# Altium project AMC_FMC_Carrier.PrjPcb (part 5 of 9)

## Sheet FPGA_SUP.SchDoc
size A2; DocumentNumber: 16; SheetNumber: 16; SheetTotal: 30
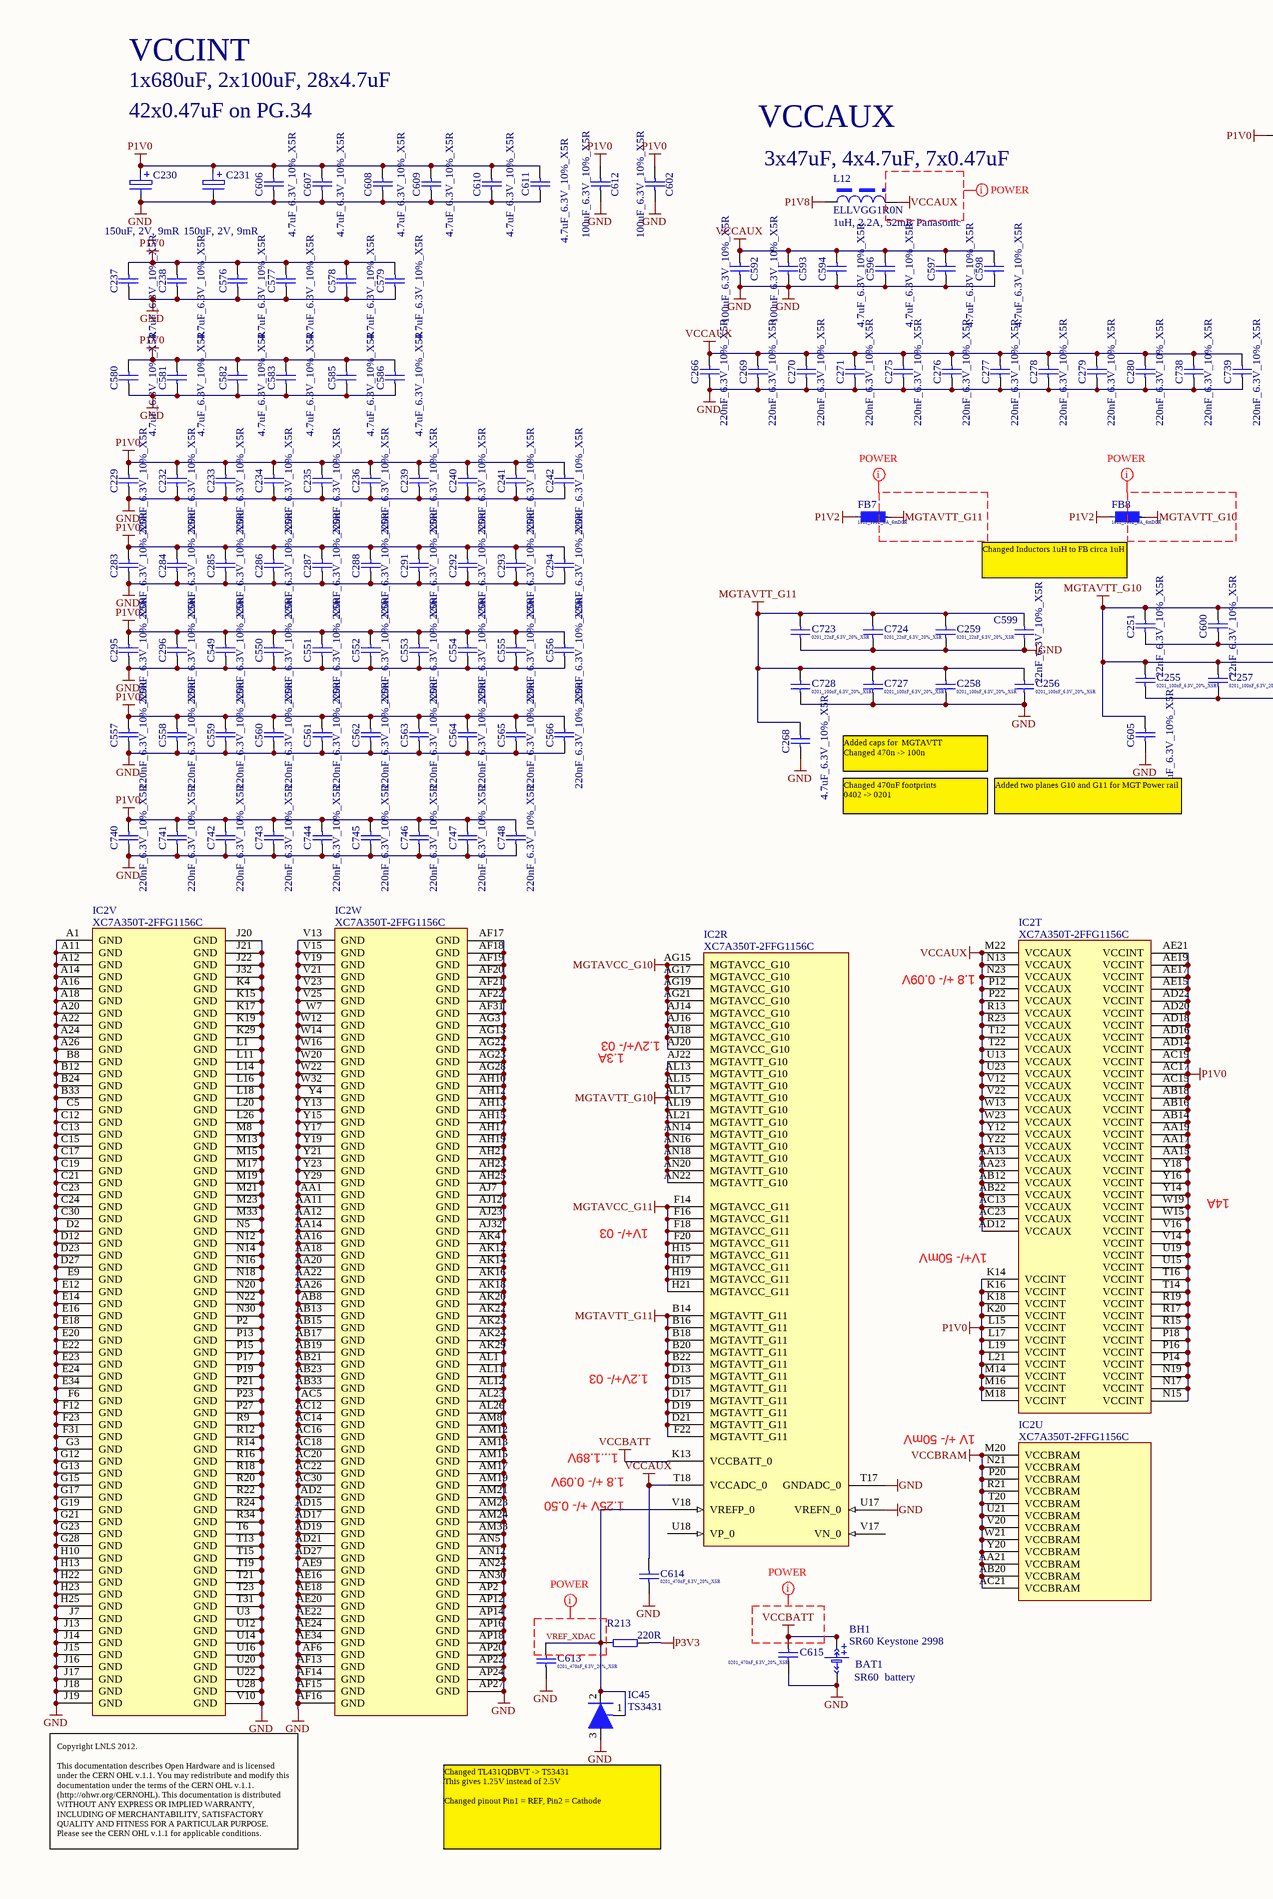
[diagram p9: FPGA_SUP.SchDoc, left]
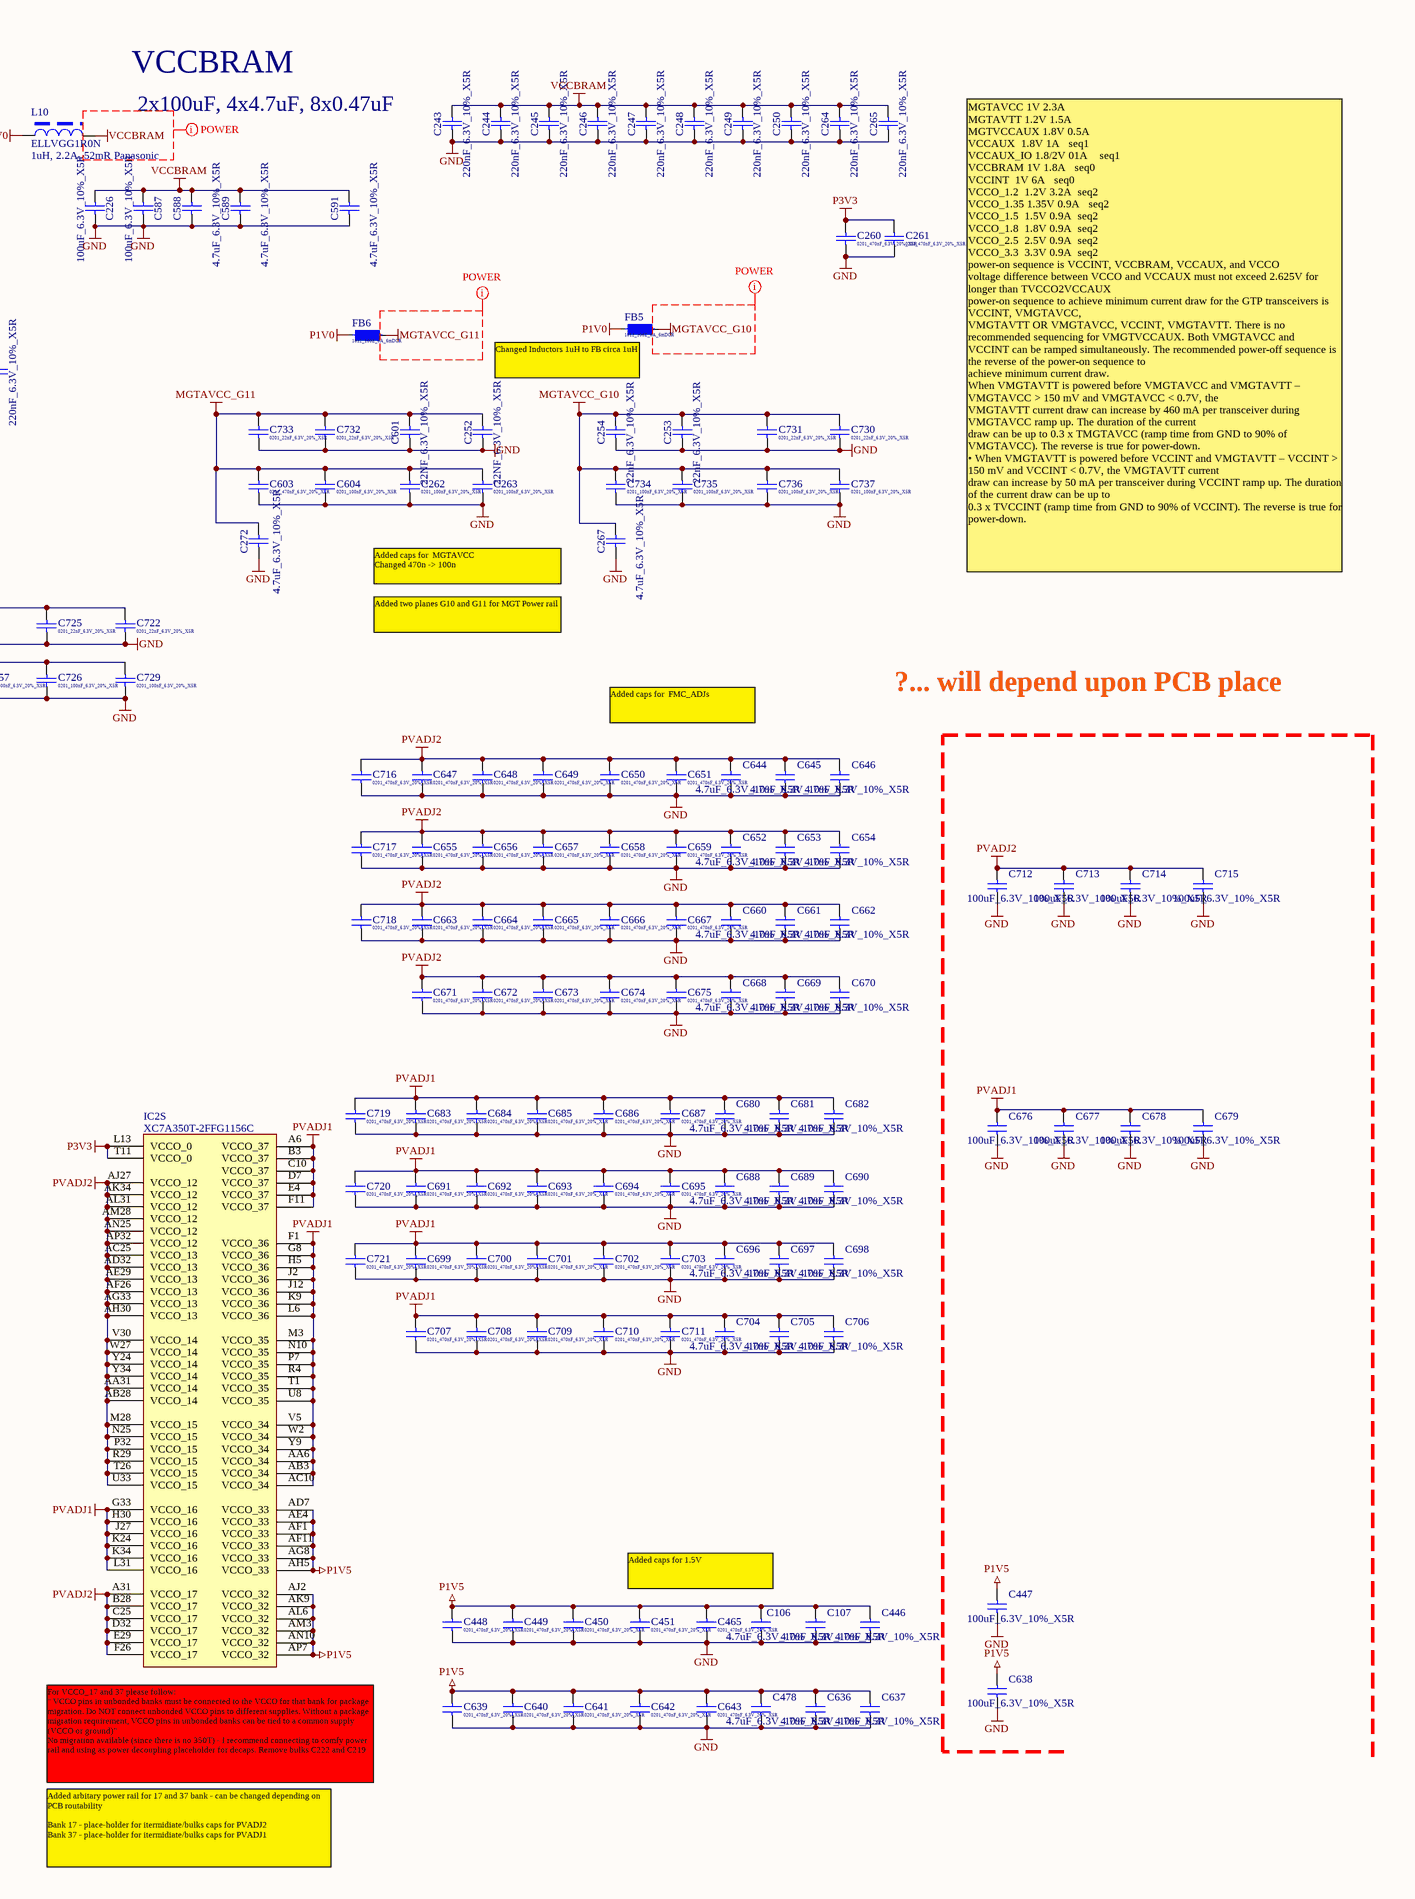
[diagram p10: FPGA_SUP.SchDoc, right]

### Parts
BAT1  SR60  battery  [SR60]
BH1  SR60 Keystone 2998  [keystone_2998]
C106  4.7uF_6.3V_10%_X5R  [CAPC1608X87N]
C107  4.7uF_6.3V_10%_X5R  [CAPC1608X87N]
C226  100uF_6.3V_10%_X5R  [CAPC3225X270N]
C229  220nF_6.3V_10%_X5R  [CAPC0603X33N]
C230  value 150uF, 2V, 9mR  [2917_POLY]  (hidden comment: ECASD40D157M009K00)
C231  value 150uF, 2V, 9mR  [2917_POLY]  (hidden comment: ECASD40D157M009K00)
C232  220nF_6.3V_10%_X5R  [CAPC0603X33N]
C233  220nF_6.3V_10%_X5R  [CAPC0603X33N]
C234  220nF_6.3V_10%_X5R  [CAPC0603X33N]
C235  220nF_6.3V_10%_X5R  [CAPC0603X33N]
C236  220nF_6.3V_10%_X5R  [CAPC0603X33N]
C237  4.7uF_6.3V_10%_X5R  [CAPC1608X87N]
C238  4.7uF_6.3V_10%_X5R  [CAPC1608X87N]
C239  220nF_6.3V_10%_X5R  [CAPC0603X33N]
C240  220nF_6.3V_10%_X5R  [CAPC0603X33N]
C241  220nF_6.3V_10%_X5R  [CAPC0603X33N]
C242  220nF_6.3V_10%_X5R  [CAPC0603X33N]
C243  220nF_6.3V_10%_X5R  [CAPC0603X33N]
C244  220nF_6.3V_10%_X5R  [CAPC0603X33N]
C245  220nF_6.3V_10%_X5R  [CAPC0603X33N]
C246  220nF_6.3V_10%_X5R  [CAPC0603X33N]
C247  220nF_6.3V_10%_X5R  [CAPC0603X33N]
C248  220nF_6.3V_10%_X5R  [CAPC0603X33N]
C249  220nF_6.3V_10%_X5R  [CAPC0603X33N]
C250  220nF_6.3V_10%_X5R  [CAPC0603X33N]
C251  22nF_6.3V_10%_X5R  [CAPC0603X33N]
C252  22NF_6.3V_10%_X5R  [CAPC0603X33N]
C253  22nF_6.3V_10%_X5R  [CAPC0603X33N]
C254  22nF_6.3V_10%_X5R  [CAPC0603X33N]
C255  0201_100nF_6.3V_20%_X5R  [CAPC0603X33N]
C256  0201_100nF_6.3V_20%_X5R  [CAPC0603X33N]
C257  0201_100nF_6.3V_20%_X5R  [CAPC0603X33N]
C258  0201_100nF_6.3V_20%_X5R  [CAPC0603X33N]
C259  0201_22nF_6.3V_20%_X5R  [CAPC0603X33N]
C260  0201_470nF_6.3V_20%_X5R  [CAPC0603X33N]
C261  0201_470nF_6.3V_20%_X5R  [CAPC0603X33N]
C262  0201_100nF_6.3V_20%_X5R  [CAPC0603X33N]
C263  0201_100nF_6.3V_20%_X5R  [CAPC0603X33N]
C264  220nF_6.3V_10%_X5R  [CAPC0603X33N]
C265  220nF_6.3V_10%_X5R  [CAPC0603X33N]
C266  220nF_6.3V_10%_X5R  [CAPC0603X33N]
C267  4.7uF_6.3V_10%_X5R  [CAPC1608X87N]
C268  4.7uF_6.3V_10%_X5R  [CAPC1608X87N]
C269  220nF_6.3V_10%_X5R  [CAPC0603X33N]
C270  220nF_6.3V_10%_X5R  [CAPC0603X33N]
C271  220nF_6.3V_10%_X5R  [CAPC0603X33N]
C272  4.7uF_6.3V_10%_X5R  [CAPC1608X87N]
C275  220nF_6.3V_10%_X5R  [CAPC0603X33N]
C276  220nF_6.3V_10%_X5R  [CAPC0603X33N]
C277  220nF_6.3V_10%_X5R  [CAPC0603X33N]
C278  220nF_6.3V_10%_X5R  [CAPC0603X33N]
C279  220nF_6.3V_10%_X5R  [CAPC0603X33N]
C280  220nF_6.3V_10%_X5R  [CAPC0603X33N]
C283  220nF_6.3V_10%_X5R  [CAPC0603X33N]
C284  220nF_6.3V_10%_X5R  [CAPC0603X33N]
C285  220nF_6.3V_10%_X5R  [CAPC0603X33N]
C286  220nF_6.3V_10%_X5R  [CAPC0603X33N]
C287  220nF_6.3V_10%_X5R  [CAPC0603X33N]
C288  220nF_6.3V_10%_X5R  [CAPC0603X33N]
C291  220nF_6.3V_10%_X5R  [CAPC0603X33N]
C292  220nF_6.3V_10%_X5R  [CAPC0603X33N]
C293  220nF_6.3V_10%_X5R  [CAPC0603X33N]
C294  220nF_6.3V_10%_X5R  [CAPC0603X33N]
C295  220nF_6.3V_10%_X5R  [CAPC0603X33N]
C296  220nF_6.3V_10%_X5R  [CAPC0603X33N]
C446  4.7uF_6.3V_10%_X5R  [CAPC1608X87N]
C447  100uF_6.3V_10%_X5R  [CAPC3225X270N]
C448  0201_470nF_6.3V_20%_X5R  [CAPC0603X33N]
C449  0201_470nF_6.3V_20%_X5R  [CAPC0603X33N]
C450  0201_470nF_6.3V_20%_X5R  [CAPC0603X33N]
C451  0201_470nF_6.3V_20%_X5R  [CAPC0603X33N]
C465  0201_470nF_6.3V_20%_X5R  [CAPC0603X33N]
C478  4.7uF_6.3V_10%_X5R  [CAPC1608X87N]
C549  220nF_6.3V_10%_X5R  [CAPC0603X33N]
C550  220nF_6.3V_10%_X5R  [CAPC0603X33N]
C551  220nF_6.3V_10%_X5R  [CAPC0603X33N]
C552  220nF_6.3V_10%_X5R  [CAPC0603X33N]
C553  220nF_6.3V_10%_X5R  [CAPC0603X33N]
C554  220nF_6.3V_10%_X5R  [CAPC0603X33N]
C555  220nF_6.3V_10%_X5R  [CAPC0603X33N]
C556  220nF_6.3V_10%_X5R  [CAPC0603X33N]
C557  220nF_6.3V_10%_X5R  [CAPC0603X33N]
C558  220nF_6.3V_10%_X5R  [CAPC0603X33N]
C559  220nF_6.3V_10%_X5R  [CAPC0603X33N]
C560  220nF_6.3V_10%_X5R  [CAPC0603X33N]
C561  220nF_6.3V_10%_X5R  [CAPC0603X33N]
C562  220nF_6.3V_10%_X5R  [CAPC0603X33N]
C563  220nF_6.3V_10%_X5R  [CAPC0603X33N]
C564  220nF_6.3V_10%_X5R  [CAPC0603X33N]
C565  220nF_6.3V_10%_X5R  [CAPC0603X33N]
C566  220nF_6.3V_10%_X5R  [CAPC0603X33N]
C576  4.7uF_6.3V_10%_X5R  [CAPC1608X87N]
C577  4.7uF_6.3V_10%_X5R  [CAPC1608X87N]
C578  4.7uF_6.3V_10%_X5R  [CAPC1608X87N]
C579  4.7uF_6.3V_10%_X5R  [CAPC1608X87N]
C580  4.7uF_6.3V_10%_X5R  [CAPC1608X87N]
C581  4.7uF_6.3V_10%_X5R  [CAPC1608X87N]
C582  4.7uF_6.3V_10%_X5R  [CAPC1608X87N]
C583  4.7uF_6.3V_10%_X5R  [CAPC1608X87N]
C585  4.7uF_6.3V_10%_X5R  [CAPC1608X87N]
C586  4.7uF_6.3V_10%_X5R  [CAPC1608X87N]
C587  100uF_6.3V_10%_X5R  [CAPC3225X270N]
C588  4.7uF_6.3V_10%_X5R  [CAPC1608X87N]
C589  4.7uF_6.3V_10%_X5R  [CAPC1608X87N]
C591  4.7uF_6.3V_10%_X5R  [CAPC1608X87N]
C592  100uF_6.3V_10%_X5R  [CAPC3225X270N]
C593  100uF_6.3V_10%_X5R  [CAPC3225X270N]
C594  4.7uF_6.3V_10%_X5R  [CAPC1608X87N]
C596  4.7uF_6.3V_10%_X5R  [CAPC1608X87N]
C597  4.7uF_6.3V_10%_X5R  [CAPC1608X87N]
C598  4.7uF_6.3V_10%_X5R  [CAPC1608X87N]
C599  22nF_6.3V_10%_X5R  [CAPC0603X33N]
C600  22nF_6.3V_10%_X5R  [CAPC0603X33N]
C601  22NF_6.3V_10%_X5R  [CAPC0603X33N]
C602  100uF_6.3V_10%_X5R  [CAPC3225X270N]
C603  0201_470nF_6.3V_20%_X5R  [CAPC0603X33N]
C604  0201_100nF_6.3V_20%_X5R  [CAPC0603X33N]
C605  4.7uF_6.3V_10%_X5R  [CAPC1608X87N]
C606  4.7uF_6.3V_10%_X5R  [CAPC1608X87N]
C607  4.7uF_6.3V_10%_X5R  [CAPC1608X87N]
C608  4.7uF_6.3V_10%_X5R  [CAPC1608X87N]
C609  4.7uF_6.3V_10%_X5R  [CAPC1608X87N]
C610  4.7uF_6.3V_10%_X5R  [CAPC1608X87N]
C611  4.7uF_6.3V_10%_X5R  [CAPC1608X87N]
C612  100uF_6.3V_10%_X5R  [CAPC3225X270N]
C613  0201_470nF_6.3V_20%_X5R  [CAPC0603X33N]
C614  0201_470nF_6.3V_20%_X5R  [CAPC0603X33N]
C615  0201_470nF_6.3V_20%_X5R  [CAPC0603X33N]
C636  4.7uF_6.3V_10%_X5R  [CAPC1608X87N]
C637  4.7uF_6.3V_10%_X5R  [CAPC1608X87N]
C638  100uF_6.3V_10%_X5R  [CAPC3225X270N]
C639  0201_470nF_6.3V_20%_X5R  [CAPC0603X33N]
C640  0201_470nF_6.3V_20%_X5R  [CAPC0603X33N]
C641  0201_470nF_6.3V_20%_X5R  [CAPC0603X33N]
C642  0201_470nF_6.3V_20%_X5R  [CAPC0603X33N]
C643  0201_470nF_6.3V_20%_X5R  [CAPC0603X33N]
C644  4.7uF_6.3V_10%_X5R  [CAPC1608X87N]
C645  4.7uF_6.3V_10%_X5R  [CAPC1608X87N]
C646  4.7uF_6.3V_10%_X5R  [CAPC1608X87N]
C647  0201_470nF_6.3V_20%_X5R  [CAPC0603X33N]
C648  0201_470nF_6.3V_20%_X5R  [CAPC0603X33N]
C649  0201_470nF_6.3V_20%_X5R  [CAPC0603X33N]
C650  0201_470nF_6.3V_20%_X5R  [CAPC0603X33N]
C651  0201_470nF_6.3V_20%_X5R  [CAPC0603X33N]
C652  4.7uF_6.3V_10%_X5R  [CAPC1608X87N]
C653  4.7uF_6.3V_10%_X5R  [CAPC1608X87N]
C654  4.7uF_6.3V_10%_X5R  [CAPC1608X87N]
C655  0201_470nF_6.3V_20%_X5R  [CAPC0603X33N]
C656  0201_470nF_6.3V_20%_X5R  [CAPC0603X33N]
C657  0201_470nF_6.3V_20%_X5R  [CAPC0603X33N]
C658  0201_470nF_6.3V_20%_X5R  [CAPC0603X33N]
C659  0201_470nF_6.3V_20%_X5R  [CAPC0603X33N]
C660  4.7uF_6.3V_10%_X5R  [CAPC1608X87N]
C661  4.7uF_6.3V_10%_X5R  [CAPC1608X87N]
C662  4.7uF_6.3V_10%_X5R  [CAPC1608X87N]
C663  0201_470nF_6.3V_20%_X5R  [CAPC0603X33N]
C664  0201_470nF_6.3V_20%_X5R  [CAPC0603X33N]
C665  0201_470nF_6.3V_20%_X5R  [CAPC0603X33N]
C666  0201_470nF_6.3V_20%_X5R  [CAPC0603X33N]
C667  0201_470nF_6.3V_20%_X5R  [CAPC0603X33N]
C668  4.7uF_6.3V_10%_X5R  [CAPC1608X87N]
C669  4.7uF_6.3V_10%_X5R  [CAPC1608X87N]
C670  4.7uF_6.3V_10%_X5R  [CAPC1608X87N]
C671  0201_470nF_6.3V_20%_X5R  [CAPC0603X33N]
C672  0201_470nF_6.3V_20%_X5R  [CAPC0603X33N]
C673  0201_470nF_6.3V_20%_X5R  [CAPC0603X33N]
C674  0201_470nF_6.3V_20%_X5R  [CAPC0603X33N]
C675  0201_470nF_6.3V_20%_X5R  [CAPC0603X33N]
C676  100uF_6.3V_10%_X5R  [CAPC3225X270N]
C677  100uF_6.3V_10%_X5R  [CAPC3225X270N]
C678  100uF_6.3V_10%_X5R  [CAPC3225X270N]
C679  100uF_6.3V_10%_X5R  [CAPC3225X270N]
C680  4.7uF_6.3V_10%_X5R  [CAPC1608X87N]
C681  4.7uF_6.3V_10%_X5R  [CAPC1608X87N]
C682  4.7uF_6.3V_10%_X5R  [CAPC1608X87N]
C683  0201_470nF_6.3V_20%_X5R  [CAPC0603X33N]
C684  0201_470nF_6.3V_20%_X5R  [CAPC0603X33N]
C685  0201_470nF_6.3V_20%_X5R  [CAPC0603X33N]
C686  0201_470nF_6.3V_20%_X5R  [CAPC0603X33N]
C687  0201_470nF_6.3V_20%_X5R  [CAPC0603X33N]
C688  4.7uF_6.3V_10%_X5R  [CAPC1608X87N]
C689  4.7uF_6.3V_10%_X5R  [CAPC1608X87N]
C690  4.7uF_6.3V_10%_X5R  [CAPC1608X87N]
C691  0201_470nF_6.3V_20%_X5R  [CAPC0603X33N]
C692  0201_470nF_6.3V_20%_X5R  [CAPC0603X33N]
C693  0201_470nF_6.3V_20%_X5R  [CAPC0603X33N]
C694  0201_470nF_6.3V_20%_X5R  [CAPC0603X33N]
C695  0201_470nF_6.3V_20%_X5R  [CAPC0603X33N]
C696  4.7uF_6.3V_10%_X5R  [CAPC1608X87N]
C697  4.7uF_6.3V_10%_X5R  [CAPC1608X87N]
C698  4.7uF_6.3V_10%_X5R  [CAPC1608X87N]
C699  0201_470nF_6.3V_20%_X5R  [CAPC0603X33N]
C700  0201_470nF_6.3V_20%_X5R  [CAPC0603X33N]
C701  0201_470nF_6.3V_20%_X5R  [CAPC0603X33N]
C702  0201_470nF_6.3V_20%_X5R  [CAPC0603X33N]
C703  0201_470nF_6.3V_20%_X5R  [CAPC0603X33N]
C704  4.7uF_6.3V_10%_X5R  [CAPC1608X87N]
C705  4.7uF_6.3V_10%_X5R  [CAPC1608X87N]
C706  4.7uF_6.3V_10%_X5R  [CAPC1608X87N]
C707  0201_470nF_6.3V_20%_X5R  [CAPC0603X33N]
C708  0201_470nF_6.3V_20%_X5R  [CAPC0603X33N]
C709  0201_470nF_6.3V_20%_X5R  [CAPC0603X33N]
C710  0201_470nF_6.3V_20%_X5R  [CAPC0603X33N]
C711  0201_470nF_6.3V_20%_X5R  [CAPC0603X33N]
C712  100uF_6.3V_10%_X5R  [CAPC3225X270N]
C713  100uF_6.3V_10%_X5R  [CAPC3225X270N]
C714  100uF_6.3V_10%_X5R  [CAPC3225X270N]
C715  100uF_6.3V_10%_X5R  [CAPC3225X270N]
C716  0201_470nF_6.3V_20%_X5R  [CAPC0603X33N]
C717  0201_470nF_6.3V_20%_X5R  [CAPC0603X33N]
C718  0201_470nF_6.3V_20%_X5R  [CAPC0603X33N]
C719  0201_470nF_6.3V_20%_X5R  [CAPC0603X33N]
C720  0201_470nF_6.3V_20%_X5R  [CAPC0603X33N]
C721  0201_470nF_6.3V_20%_X5R  [CAPC0603X33N]
C722  0201_22nF_6.3V_20%_X5R  [CAPC0603X33N]
C723  0201_22nF_6.3V_20%_X5R  [CAPC0603X33N]
C724  0201_22nF_6.3V_20%_X5R  [CAPC0603X33N]
C725  0201_22nF_6.3V_20%_X5R  [CAPC0603X33N]
C726  0201_100nF_6.3V_20%_X5R  [CAPC0603X33N]
C727  0201_100nF_6.3V_20%_X5R  [CAPC0603X33N]
C728  0201_100nF_6.3V_20%_X5R  [CAPC0603X33N]
C729  0201_100nF_6.3V_20%_X5R  [CAPC0603X33N]
C730  0201_22nF_6.3V_20%_X5R  [CAPC0603X33N]
C731  0201_22nF_6.3V_20%_X5R  [CAPC0603X33N]
C732  0201_22nF_6.3V_20%_X5R  [CAPC0603X33N]
C733  0201_22nF_6.3V_20%_X5R  [CAPC0603X33N]
C734  0201_100nF_6.3V_20%_X5R  [CAPC0603X33N]
C735  0201_100nF_6.3V_20%_X5R  [CAPC0603X33N]
C736  0201_100nF_6.3V_20%_X5R  [CAPC0603X33N]
C737  0201_100nF_6.3V_20%_X5R  [CAPC0603X33N]
C738  220nF_6.3V_10%_X5R  [CAPC0603X33N]
C739  220nF_6.3V_10%_X5R  [CAPC0603X33N]
C740  220nF_6.3V_10%_X5R  [CAPC0603X33N]
C741  220nF_6.3V_10%_X5R  [CAPC0603X33N]
C742  220nF_6.3V_10%_X5R  [CAPC0603X33N]
C743  220nF_6.3V_10%_X5R  [CAPC0603X33N]
C744  220nF_6.3V_10%_X5R  [CAPC0603X33N]
C745  220nF_6.3V_10%_X5R  [CAPC0603X33N]
C746  220nF_6.3V_10%_X5R  [CAPC0603X33N]
C747  220nF_6.3V_10%_X5R  [CAPC0603X33N]
C748  220nF_6.3V_10%_X5R  [CAPC0603X33N]
FB5  1812_100Z_8A_6mDCR  [INDC4532X340N]
FB6  1812_100Z_8A_6mDCR  [INDC4532X340N]
FB7  1812_100Z_8A_6mDCR  [INDC4532X340N]
FB8  1812_100Z_8A_6mDCR  [INDC4532X340N]
IC2  XC7A350T-2FFG1156C  [BGA1156C100P34X34_3500X3500X335]  (parts R,S,T,U,V,W of 23)
IC45  TS3431  [SOT-23]
L10  ELLVGG1R0N  [L_ELLVGG2R2N]
L12  ELLVGG1R0N  [L_ELLVGG2R2N]
R213  220R  [0402R]

### Nets
GND: BH1.neg(+) C106.1 C107.1 C226.2 C229.1 C230.2 C231.2 C232.1 C233.1 C234.1 C235.1 C236.1 C237.1 C238.1 C239.1 C240.1 C241.1 C242.1 C243.1 C244.1 C245.1 C246.1 C247.1 C248.1 C249.1 C250.1 C251.1 C252.1 C253.1 C254.1 C255.1 C256.1 C257.1 C258.1 C259.1 C260.1 C261.1 C262.1 C263.1 C264.1 C265.1 C266.1 C267.1 C268.1 C269.1 C270.1 C271.1 C272.1 C275.1 C276.1 C277.1 C278.1 C279.1 C280.1 C283.1 C284.1 C285.1 C286.1 C287.1 C288.1 C291.1 C292.1 C293.1 C294.1 C295.1 C296.1 C446.1 C447.2 C448.1 C449.1 C450.1 C451.1 C465.1 C478.1 C549.1 C550.1 C551.1 C552.1 C553.1 C554.1 C555.1 C556.1 C557.1 C558.1 C559.1 C560.1 C561.1 C562.1 C563.1 C564.1 C565.1 C566.1 C576.1 C577.1 C578.1 C579.1 C580.1 C581.1 C582.1 C583.1 C585.1 C586.1 C587.2 C588.1 C589.1 C591.1 C592.2 C593.2 C594.1 C596.1 C597.1 C598.1 C599.1 C600.1 C601.1 C602.2 C603.1 C604.1 C605.1 C606.1 C607.1 C608.1 C609.1 C610.1 C611.1 C612.2 C613.1 C614.1 C615.1 C636.1 C637.1 C638.2 C639.1 C640.1 C641.1 C642.1 C643.1 C644.1 C645.1 C646.1 C647.1 C648.1 C649.1 C650.1 C651.1 C652.1 C653.1 C654.1 C655.1 C656.1 C657.1 C658.1 C659.1 C660.1 C661.1 C662.1 C663.1 C664.1 C665.1 C666.1 C667.1 C668.1 C669.1 C670.1 C671.1 C672.1 C673.1 C674.1 C675.1 C676.2 C677.2 C678.2 C679.2 C680.1 C681.1 C682.1 C683.1 C684.1 C685.1 C686.1 C687.1 C688.1 C689.1 C690.1 C691.1 C692.1 C693.1 C694.1 C695.1 C696.1 C697.1 C698.1 C699.1 C700.1 C701.1 C702.1 C703.1 C704.1 C705.1 C706.1 C707.1 C708.1 C709.1 C710.1 C711.1 C712.2 C713.2 C714.2 C715.2 C716.1 C717.1 C718.1 C719.1 C720.1 C721.1 C722.1 C723.1 C724.1 C725.1 C726.1 C727.1 C728.1 C729.1 C730.1 C731.1 C732.1 C733.1 C734.1 C735.1 C736.1 C737.1 C738.1 C739.1 C740.1 C741.1 C742.1 C743.1 C744.1 C745.1 C746.1 C747.1 C748.1 IC2.A1(GND) IC2.A11(GND) IC2.A12(GND) IC2.A14(GND) IC2.A16(GND) IC2.A18(GND) IC2.A20(GND) IC2.A22(GND) IC2.A24(GND) IC2.A26(GND) IC2.AA1(GND) IC2.AA11(GND) IC2.AA12(GND) IC2.AA14(GND) IC2.AA16(GND) IC2.AA18(GND) IC2.AA20(GND) IC2.AA22(GND) IC2.AA26(GND) IC2.AB8(GND) IC2.AB13(GND) IC2.AB15(GND) IC2.AB17(GND) IC2.AB19(GND) IC2.AB21(GND) IC2.AB23(GND) IC2.AB33(GND) IC2.AC5(GND) IC2.AC12(GND) IC2.AC14(GND) IC2.AC16(GND) IC2.AC18(GND) IC2.AC20(GND) IC2.AC22(GND) IC2.AC30(GND) IC2.AD2(GND) IC2.AD15(GND) IC2.AD17(GND) IC2.AD19(GND) IC2.AD21(GND) IC2.AD27(GND) IC2.AE9(GND) IC2.AE16(GND) IC2.AE18(GND) IC2.AE20(GND) IC2.AE22(GND) IC2.AE24(GND) IC2.AE34(GND) IC2.AF6(GND) IC2.AF13(GND) IC2.AF14(GND) IC2.AF15(GND) IC2.AF16(GND) IC2.AF17(GND) IC2.AF18(GND) IC2.AF19(GND) IC2.AF20(GND) IC2.AF21(GND) IC2.AF22(GND) IC2.AF31(GND) IC2.AG3(GND) IC2.AG13(GND) IC2.AG22(GND) IC2.AG23(GND) IC2.AG28(GND) IC2.AH10(GND) IC2.AH12(GND) IC2.AH13(GND) IC2.AH15(GND) IC2.AH17(GND) IC2.AH19(GND) IC2.AH21(GND) IC2.AH23(GND) IC2.AH25(GND) IC2.AJ7(GND) IC2.AJ12(GND) IC2.AJ23(GND) IC2.AJ32(GND) IC2.AK4(GND) IC2.AK12(GND) IC2.AK14(GND) IC2.AK16(GND) IC2.AK18(GND) IC2.AK20(GND) IC2.AK22(GND) IC2.AK23(GND) IC2.AK24(GND) IC2.AK29(GND) IC2.AL1(GND) IC2.AL11(GND) IC2.AL12(GND) IC2.AL23(GND) IC2.AL26(GND) IC2.AM8(GND) IC2.AM12(GND) IC2.AM13(GND) IC2.AM15(GND) IC2.AM17(GND) IC2.AM19(GND) IC2.AM21(GND) IC2.AM23(GND) IC2.AM24(GND) IC2.AM33(GND) IC2.AN5(GND) IC2.AN12(GND) IC2.AN24(GND) IC2.AN30(GND) IC2.AP2(GND) IC2.AP12(GND) IC2.AP14(GND) IC2.AP16(GND) IC2.AP18(GND) IC2.AP20(GND) IC2.AP22(GND) IC2.AP24(GND) IC2.AP27(GND) IC2.B8(GND) IC2.B12(GND) IC2.B24(GND) IC2.B33(GND) IC2.C5(GND) IC2.C12(GND) IC2.C13(GND) IC2.C15(GND) IC2.C17(GND) IC2.C19(GND) IC2.C21(GND) IC2.C23(GND) IC2.C24(GND) IC2.C30(GND) IC2.D2(GND) IC2.D12(GND) IC2.D23(GND) IC2.D27(GND) IC2.E9(GND) IC2.E12(GND) IC2.E14(GND) IC2.E16(GND) IC2.E18(GND) IC2.E20(GND) IC2.E22(GND) IC2.E23(GND) IC2.E24(GND) IC2.E34(GND) IC2.F6(GND) IC2.F12(GND) IC2.F23(GND) IC2.F31(GND) IC2.G3(GND) IC2.G12(GND) IC2.G13(GND) IC2.G15(GND) IC2.G17(GND) IC2.G19(GND) IC2.G21(GND) IC2.G23(GND) IC2.G28(GND) IC2.H10(GND) IC2.H13(GND) IC2.H22(GND) IC2.H23(GND) IC2.H25(GND) IC2.J7(GND) IC2.J13(GND) IC2.J14(GND) IC2.J15(GND) IC2.J16(GND) IC2.J17(GND) IC2.J18(GND) IC2.J19(GND) IC2.J20(GND) IC2.J21(GND) IC2.J22(GND) IC2.J32(GND) IC2.K4(GND) IC2.K15(GND) IC2.K17(GND) IC2.K19(GND) IC2.K29(GND) IC2.L1(GND) IC2.L11(GND) IC2.L14(GND) IC2.L16(GND) IC2.L18(GND) IC2.L20(GND) IC2.L26(GND) IC2.M8(GND) IC2.M13(GND) IC2.M15(GND) IC2.M17(GND) IC2.M19(GND) IC2.M21(GND) IC2.M23(GND) IC2.M33(GND) IC2.N5(GND) IC2.N12(GND) IC2.N14(GND) IC2.N16(GND) IC2.N18(GND) IC2.N20(GND) IC2.N22(GND) IC2.N30(GND) IC2.P2(GND) IC2.P13(GND) IC2.P15(GND) IC2.P17(GND) IC2.P19(GND) IC2.P21(GND) IC2.P23(GND) IC2.P27(GND) IC2.R9(GND) IC2.R12(GND) IC2.R14(GND) IC2.R16(GND) IC2.R18(GND) IC2.R20(GND) IC2.R22(GND) IC2.R24(GND) IC2.R34(GND) IC2.T6(GND) IC2.T13(GND) IC2.T15(GND) IC2.T17(GNDADC_0) IC2.T19(GND) IC2.T21(GND) IC2.T23(GND) IC2.T31(GND) IC2.U3(GND) IC2.U12(GND) IC2.U14(GND) IC2.U16(GND) IC2.U17(VREFN_0) IC2.U20(GND) IC2.U22(GND) IC2.U28(GND) IC2.V10(GND) IC2.V13(GND) IC2.V15(GND) IC2.V19(GND) IC2.V21(GND) IC2.V23(GND) IC2.V25(GND) IC2.W7(GND) IC2.W12(GND) IC2.W14(GND) IC2.W16(GND) IC2.W20(GND) IC2.W22(GND) IC2.W32(GND) IC2.Y4(GND) IC2.Y13(GND) IC2.Y15(GND) IC2.Y17(GND) IC2.Y19(GND) IC2.Y21(GND) IC2.Y23(GND) IC2.Y29(GND) IC45.3(A)
MGTAVCC_G10: C253.2 C254.2 C267.2 C730.2 C731.2 C734.2 C735.2 C736.2 C737.2 FB5.2(-) IC2.AG15(MGTAVCC_G10) IC2.AG17(MGTAVCC_G10) IC2.AG19(MGTAVCC_G10) IC2.AG21(MGTAVCC_G10) IC2.AJ14(MGTAVCC_G10) IC2.AJ16(MGTAVCC_G10) IC2.AJ18(MGTAVCC_G10) IC2.AJ20(MGTAVCC_G10)
MGTAVCC_G11: C252.2 C262.2 C263.2 C272.2 C601.2 C603.2 C604.2 C732.2 C733.2 FB6.2(-) IC2.F14(MGTAVCC_G11) IC2.F16(MGTAVCC_G11) IC2.F18(MGTAVCC_G11) IC2.F20(MGTAVCC_G11) IC2.H15(MGTAVCC_G11) IC2.H17(MGTAVCC_G11) IC2.H19(MGTAVCC_G11) IC2.H21(MGTAVCC_G11)
MGTAVTT_G10: C251.2 C255.2 C257.2 C600.2 C605.2 C722.2 C725.2 C726.2 C729.2 FB8.2(-) IC2.AJ22(MGTAVTT_G10) IC2.AL13(MGTAVTT_G10) IC2.AL15(MGTAVTT_G10) IC2.AL17(MGTAVTT_G10) IC2.AL19(MGTAVTT_G10) IC2.AL21(MGTAVTT_G10) IC2.AN14(MGTAVTT_G10) IC2.AN16(MGTAVTT_G10) IC2.AN18(MGTAVTT_G10) IC2.AN20(MGTAVTT_G10) IC2.AN22(MGTAVTT_G10)
MGTAVTT_G11: C256.2 C258.2 C259.2 C268.2 C599.2 C723.2 C724.2 C727.2 C728.2 FB7.2(-) IC2.B14(MGTAVTT_G11) IC2.B16(MGTAVTT_G11) IC2.B18(MGTAVTT_G11) IC2.B20(MGTAVTT_G11) IC2.B22(MGTAVTT_G11) IC2.D13(MGTAVTT_G11) IC2.D15(MGTAVTT_G11) IC2.D17(MGTAVTT_G11) IC2.D19(MGTAVTT_G11) IC2.D21(MGTAVTT_G11) IC2.F22(MGTAVTT_G11)
P1V0: C229.2 C230.1 C231.1 C232.2 C233.2 C234.2 C235.2 C236.2 C237.2 C238.2 C239.2 C240.2 C241.2 C242.2 C283.2 C284.2 C285.2 C286.2 C287.2 C288.2 C291.2 C292.2 C293.2 C294.2 C295.2 C296.2 C549.2 C550.2 C551.2 C552.2 C553.2 C554.2 C555.2 C556.2 C557.2 C558.2 C559.2 C560.2 C561.2 C562.2 C563.2 C564.2 C565.2 C566.2 C576.2 C577.2 C578.2 C579.2 C580.2 C581.2 C582.2 C583.2 C585.2 C586.2 C602.1 C606.2 C607.2 C608.2 C609.2 C610.2 C611.2 C612.1 C740.2 C741.2 C742.2 C743.2 C744.2 C745.2 C746.2 C747.2 C748.2 FB5.1(+) FB6.1(+) IC2.AA15(VCCINT) IC2.AA17(VCCINT) IC2.AA19(VCCINT) IC2.AB14(VCCINT) IC2.AB16(VCCINT) IC2.AB18(VCCINT) IC2.AC15(VCCINT) IC2.AC17(VCCINT) IC2.AC19(VCCINT) IC2.AD14(VCCINT) IC2.AD16(VCCINT) IC2.AD18(VCCINT) IC2.AD20(VCCINT) IC2.AD22(VCCINT) IC2.AE15(VCCINT) IC2.AE17(VCCINT) IC2.AE19(VCCINT) IC2.AE21(VCCINT) IC2.K14(VCCINT) IC2.K16(VCCINT) IC2.K18(VCCINT) IC2.K20(VCCINT) IC2.L15(VCCINT) IC2.L17(VCCINT) IC2.L19(VCCINT) IC2.L21(VCCINT) IC2.M14(VCCINT) IC2.M16(VCCINT) IC2.M18(VCCINT) IC2.N15(VCCINT) IC2.N17(VCCINT) IC2.N19(VCCINT) IC2.P14(VCCINT) IC2.P16(VCCINT) IC2.P18(VCCINT) IC2.R15(VCCINT) IC2.R17(VCCINT) IC2.R19(VCCINT) IC2.T14(VCCINT) IC2.T16(VCCINT) IC2.U15(VCCINT) IC2.U19(VCCINT) IC2.V14(VCCINT) IC2.V16(VCCINT) IC2.W15(VCCINT) IC2.W19(VCCINT) IC2.Y14(VCCINT) IC2.Y16(VCCINT) IC2.Y18(VCCINT) L10.1
P1V2: FB7.1(+) FB8.1(+)
P1V5: C106.2 C107.2 C446.2 C447.1 C448.2 C449.2 C450.2 C451.2 C465.2 C478.2 C636.2 C637.2 C638.1 C639.2 C640.2 C641.2 C642.2 C643.2 IC2.AD7(VCCO_33) IC2.AE4(VCCO_33) IC2.AF1(VCCO_33) IC2.AF11(VCCO_33) IC2.AG8(VCCO_33) IC2.AH5(VCCO_33) IC2.AJ2(VCCO_32) IC2.AK9(VCCO_32) IC2.AL6(VCCO_32) IC2.AM3(VCCO_32) IC2.AN10(VCCO_32) IC2.AP7(VCCO_32)
P1V8: L12.1
P3V3: C260.2 C261.2 IC2.L13(VCCO_0) IC2.T11(VCCO_0) R213.2
PVADJ1: C676.1 C677.1 C678.1 C679.1 C680.2 C681.2 C682.2 C683.2 C684.2 C685.2 C686.2 C687.2 C688.2 C689.2 C690.2 C691.2 C692.2 C693.2 C694.2 C695.2 C696.2 C697.2 C698.2 C699.2 C700.2 C701.2 C702.2 C703.2 C704.2 C705.2 C706.2 C707.2 C708.2 C709.2 C710.2 C711.2 C719.2 C720.2 C721.2 IC2.A6(VCCO_37) IC2.AA6(VCCO_34) IC2.AB3(VCCO_34) IC2.AC10(VCCO_34) IC2.B3(VCCO_37) IC2.C10(VCCO_37) IC2.D7(VCCO_37) IC2.E4(VCCO_37) IC2.F1(VCCO_36) IC2.F11(VCCO_37) IC2.G8(VCCO_36) IC2.G33(VCCO_16) IC2.H5(VCCO_36) IC2.H30(VCCO_16) IC2.J2(VCCO_36) IC2.J12(VCCO_36) IC2.J27(VCCO_16) IC2.K9(VCCO_36) IC2.K24(VCCO_16) IC2.K34(VCCO_16) IC2.L6(VCCO_36) IC2.L31(VCCO_16) IC2.M3(VCCO_35) IC2.N10(VCCO_35) IC2.P7(VCCO_35) IC2.R4(VCCO_35) IC2.T1(VCCO_35) IC2.U8(VCCO_35) IC2.V5(VCCO_34) IC2.W2(VCCO_34) IC2.Y9(VCCO_34)
PVADJ2: C644.2 C645.2 C646.2 C647.2 C648.2 C649.2 C650.2 C651.2 C652.2 C653.2 C654.2 C655.2 C656.2 C657.2 C658.2 C659.2 C660.2 C661.2 C662.2 C663.2 C664.2 C665.2 C666.2 C667.2 C668.2 C669.2 C670.2 C671.2 C672.2 C673.2 C674.2 C675.2 C712.1 C713.1 C714.1 C715.1 C716.2 C717.2 C718.2 IC2.A31(VCCO_17) IC2.AA31(VCCO_14) IC2.AB28(VCCO_14) IC2.AC25(VCCO_13) IC2.AD32(VCCO_13) IC2.AE29(VCCO_13) IC2.AF26(VCCO_13) IC2.AG33(VCCO_13) IC2.AH30(VCCO_13) IC2.AJ27(VCCO_12) IC2.AK34(VCCO_12) IC2.AL31(VCCO_12) IC2.AM28(VCCO_12) IC2.AN25(VCCO_12) IC2.AP32(VCCO_12) IC2.B28(VCCO_17) IC2.C25(VCCO_17) IC2.D32(VCCO_17) IC2.E29(VCCO_17) IC2.F26(VCCO_17) IC2.M28(VCCO_15) IC2.N25(VCCO_15) IC2.P32(VCCO_15) IC2.R29(VCCO_15) IC2.T26(VCCO_15) IC2.U33(VCCO_15) IC2.V30(VCCO_14) IC2.W27(VCCO_14) IC2.Y24(VCCO_14) IC2.Y34(VCCO_14)
VCCAUX: C266.2 C269.2 C270.2 C271.2 C275.2 C276.2 C277.2 C278.2 C279.2 C280.2 C592.1 C593.1 C594.2 C596.2 C597.2 C598.2 C614.2 C738.2 C739.2 IC2.AA13(VCCAUX) IC2.AA23(VCCAUX) IC2.AB12(VCCAUX) IC2.AB22(VCCAUX) IC2.AC13(VCCAUX) IC2.AC23(VCCAUX) IC2.AD12(VCCAUX) IC2.M22(VCCAUX) IC2.N13(VCCAUX) IC2.N23(VCCAUX) IC2.P12(VCCAUX) IC2.P22(VCCAUX) IC2.R13(VCCAUX) IC2.R23(VCCAUX) IC2.T12(VCCAUX) IC2.T18(VCCADC_0) IC2.T22(VCCAUX) IC2.U13(VCCAUX) IC2.U23(VCCAUX) IC2.V12(VCCAUX) IC2.V22(VCCAUX) IC2.W13(VCCAUX) IC2.W23(VCCAUX) IC2.Y12(VCCAUX) IC2.Y22(VCCAUX) L12.2
VCCBATT: BH1.pos1(+) BH1.pos2(+) C615.2 IC2.K13(VCCBATT_0)
VCCBRAM: C226.1 C243.2 C244.2 C245.2 C246.2 C247.2 C248.2 C249.2 C250.2 C264.2 C265.2 C587.1 C588.2 C589.2 C591.2 IC2.AA21(VCCBRAM) IC2.AB20(VCCBRAM) IC2.AC21(VCCBRAM) IC2.M20(VCCBRAM) IC2.N21(VCCBRAM) IC2.P20(VCCBRAM) IC2.R21(VCCBRAM) IC2.T20(VCCBRAM) IC2.U21(VCCBRAM) IC2.V20(VCCBRAM) IC2.W21(VCCBRAM) IC2.Y20(VCCBRAM) L10.2
VREF_XDAC: C613.2 IC2.V18(VREFP_0) IC45.1(REF) IC45.2(C) R213.1

Not connected (* = marked no-connect by the designer): IC2 U18(VP_0) V17(VN_0)

### Layout directives
net class POWER: MGTAVCC_G10, MGTAVCC_G11, MGTAVTT_G10, MGTAVTT_G11, VCCAUX, VCCBATT, VCCBRAM, VREF_XDAC

### Notes on the sheet
- VCCINT
- 1x680uF, 2x100uF, 28x4.7uF
- VCCBRAM
- 42x0.47uF on PG.34
- VCCAUX
- (near C243) 2x100uF, 4x4.7uF, 8x0.47uF
- (near L12) 3x47uF, 4x4.7uF, 7x0.47uF
- (near FB5) Changed Inductors 1uH to FB circa 1uH
- (near FB8) Changed Inductors 1uH to FB circa 1uH
- Added caps for  MGTAVCC
  Changed 470n -> 100n
- MGTAVCC	1V	2.3A
  MGTAVTT	1.2V	1.5A
  MGTVCCAUX	1.8V	0.5A
  VCCAUX		1.8V	1A			seq1
  VCCAUX_IO	1.8/2V	01A 			seq1
  VCCBRAM	1V	1.8A			seq0
  VCCINT		1V	6A			seq0
  VCCO_1.2		1.2V	3.2A		seq2
  VCCO_1.35	1.35V	0.9A			seq2
  VCCO_1.5		1.5V	0.9A		seq2
  VCCO_1.8		1.8V	0.9A		seq2
  VCCO_2.5		2.5V	0.9A		seq2
  VCCO_3.3		3.3V	0.9A		seq2
  power-on sequence is VCCINT, VCCBRAM, VCCAUX, and VCCO
  voltage difference between VCCO and VCCAUX must not exceed 2.625V for longer than TVCCO2VCCAUX
  power-on sequence to achieve minimum current draw for the GTP transceivers is VCCINT, VMGTAVCC,
  VMGTAVTT OR VMGTAVCC, VCCINT, VMGTAVTT. There is no recommended sequencing for VMGTVCCAUX. Both VMGTAVCC and
  VCCINT can be ramped simultaneously. The recommended power-off sequence is the reverse of the power-on sequence to
  achieve minimum current draw.
  When VMGTAVTT is powered before VMGTAVCC and VMGTAVTT – VMGTAVCC > 150 mV and VMGTAVCC < 0.7V, the
  VMGTAVTT current draw can increase by 460 mA per transceiver during VMGTAVCC ramp up. The duration of the current
  draw can be up to 0.3 x TMGTAVCC (ramp time from GND to 90% of VMGTAVCC). The reverse is true for power-down.
  • When VMGTAVTT is powered before VCCINT and VMGTAVTT – VCCINT > 150 mV and VCCINT < 0.7V, the VMGTAVTT current
  draw can increase by 50 mA per transceiver during VCCINT ramp up. The duration of the current draw can be up to
  0.3 x TVCCINT (ramp time from GND to 90% of VCCINT). The reverse is true for power-down.
- Added two planes G10 and G11 for MGT Power rail
- ?... will depend upon PCB place
- Added caps for  MGTAVTT
  Changed 470n -> 100n
- Added caps for  FMC_ADJs
- Changed 470nF footprints
  0402 -> 0201
- (near C605) Added two planes G10 and G11 for MGT Power rail
- (near IC2) 1.8 +/- 0.09V
- 1.3A
- (near IC2) 1.2V+/- 03
- 14A
- 1V+/- 03
- (near IC2) 1V+/- 50mV
- 1.2V+/- 03
- (near IC2) 1V +/- 50mV
- 1...1.89V
- 1.25V +/- 0.50
- 1.8 +/- 0.09V
- Added caps for 1.5V
- (near IC2) For VCCO_17 and 37 please follow:
  " VCCO pins in unbonded banks must be connected to the VCCO for that bank for package migration. Do NOT connect unbonded VCCO pins to different supplies. Without a package migration requirement, VCCO pins in unbonded banks can be tied to a common supply (VCCO or ground)"
  No migration available (since there is no 350T) - I recommend connecting to comfy power rail and using as power decoupling placeholder for decaps. Remove bulks C222 and C219
- (near IC2) Copyright LNLS 2012.
  This documentation describes Open Hardware and is licensed under the CERN OHL v.1.1. You may redistribute and modify this documentation under the terms of the CERN OHL v.1.1. (http://ohwr.org/CERNOHL). This documentation is distributed WITHOUT ANY EXPRESS OR IMPLIED WARRANTY, INCLUDING OF MERCHANTABILITY, SATISFACTORY QUALITY AND FITNESS FOR A PARTICULAR PURPOSE. Please see the CERN OHL v.1.1 for applicable conditions.
- (near IC45) Changed TL431QDBVT -> TS3431
  This gives 1.25V instead of 2.5V
  Changed pinout Pin1 = REF, Pin2 = Cathode
- Added arbitary power rail for 17 and 37 bank - can be changed depending on PCB routability
  Bank 17 - place-holder for itermidiate/bulks caps for PVADJ2
  Bank 37 - place-holder for itermidiate/bulks caps for PVADJ1
- (in symbol L_CHOKE_ELLVGG) 1uH, 2.2A, 52mR Panasonic

### Library data of the parts
BAT1 = BATTERY_SR60: SR60 6.8x2.15mm Battery 1.5V, 15mAh
BH1 = BATTERY_HOLD_SR60: SR60 Battery 1.5V 17mAh (Farnell: 1854967)
C106 C107 C237 C238 C267 C268 C272 C446 C478 C576-C583 C585 C586 C588 C589 C591 C594 C596-C598 C605-C611 C636 C637 C644-C646 C652-C654 C660-C662 C668-C670 C680-C682 C688-C690 C696-C698 C704-C706 = CC0603_4.7UF_6.3V_10%_X5R: Non-polarised capacitor; Part Description: SMD Multilayer Chip Ceramic Capacitor; Manufacturer: GENERIC; Manufacturer1 Part Number: 225520613672; Value: 4.7uF; Voltage: 6.3V; TC: X5R; Tolerance: ±10%; Table: Capacitors SMD; Part Number: CC0603_4.7UF_6.3V_10%_X5R; Component Kind: Standard; Component Type: Standard; Pin Count: 2; Status: Preferred; Manufacturer Part Number: CC0603_4.7uF_6.3V_10%_X5R; Case: 0603; Mounted: Yes; Socket: No; SMD: Yes; Manufacturer1 Example: PHYCOMP; Manufacturer1 ComponentHeight: 0.87mm; HelpURL: \\cern.ch\dfs\Applications\Altium\Datasheets\CC0805_X5R_PHYCOMP_HC.pdf; Author: CERN DEM JLC; CreateDate: 2007-12-03; LatestRevisionDate: 2007-12-03
C226 C447 C587 C592 C593 C602 C612 C638 C676-C679 C712-C715 = CC1210_100UF_6.3V_20%_X5R: Non-polarised capacitor; Part Description: SMD Multilayer Chip Ceramic Capacitor; Manufacturer: GENERIC; Manufacturer1 Part Number: GRM32ER60J107ME20L; Value: 100uF; Voltage: 6.3V; TC: X5R; Tolerance: ±20%; Table: Capacitors SMD; Part Number: CC1210_100UF_6.3V_20%_X5R; Component Kind: Standard; Component Type: Standard; Pin Count: 2; Status: Preferred; Manufacturer Part Number: CC1210_100UF_6.3V_20%_X5R; Case: 1210; Mounted: Yes; Socket: No; SMD: Yes; Manufacturer1 Example: MURATA; Manufacturer1 ComponentHeight: 2.70mm; HelpURL: \\cern.ch\dfs\Applications\Altium\Datasheets\CC1210_X5R_MURATA.pdf; Author: CERN DEM JLC; CreateDate: 2010-04-19; LatestRevisionDate: 2010-04-19
C229 C232-C236 C239-C250 C264-C266 C269-C271 C275-C280 C283-C288 C291-C296 C549-C566 C738-C748 = CC0201_220NF_6.3V_20%_X5R: Non-polarised capacitor; Part Description: SMD Multilayer Chip Ceramic Capacitor; Manufacturer: GENERIC; Manufacturer1 Part Number: JMK063BJ224MP-F; Value: 220nF; Voltage: 6.3V; TC: X5R; Tolerance: ±20%; Table: Capacitors SMD; Part Number: CC0201_220NF_6.3V_20%_X5R; Component Kind: Standard; Component Type: Standard; Pin Count: 2; Status: Not Recommended; Manufacturer Part Number: CC0201_220NF_6.3V_20%_X5R; Case: 0201; Mounted: Yes; Socket: No; SMD: Yes; Manufacturer1 Example: TAIYO YUDEN; Manufacturer1 ComponentHeight: 0.33mm; HelpURL: \\cern.ch\dfs\Applications\Altium\Datasheets\CC0201_X5R_TAIYO-YUDEN_STANDARD-CLASS2.pdf; Author: CERN DEM JLC; CreateDate: 2010-05-27; LatestRevisionDate: 2010-05-27
C230 C231 = CAP_POLYMER_SMDD: POLY, 150uF, 2V, ESR: 9mR
C251-C254 C599-C601 = CC0201_22NF_6.3V_10%_X5R: Non-polarised capacitor; Part Description: SMD Multilayer Chip Ceramic Capacitor; Manufacturer: GENERIC; Manufacturer1 Part Number: 02016D223KAT2A; Value: 22nF; Voltage: 6.3V; TC: X5R; Tolerance: ±10%; Table: Capacitors SMD; Part Number: CC0201_22NF_6.3V_10%_X5R; Component Kind: Standard; Component Type: Standard; Pin Count: 2; Status: Not Recommended; Manufacturer Part Number: CC0201_22NF_6.3V_10%_X5R; Case: 0201; Mounted: Yes; Socket: No; SMD: Yes; Manufacturer1 Example: AVX; Manufacturer1 ComponentHeight: 0.33mm; HelpURL: \\cern.ch\dfs\Applications\Altium\Datasheets\CC0201_X5R_AVX.pdf; Author: CERN DEM JLC; CreateDate: 2007-12-03; LatestRevisionDate: 2007-12-03
C255-C263 C448-C451 C465 C603 C604 C613-C615 C639-C643 C647-C651 C655-C659 C663-C667 C671-C675 C683-C687 C691-C695 C699-C703 C707-C711 C716-C737 = Ceramic_0201: MiscInfo: Biggest Cern Footprint [max height]; Document Name: FPGA_SUP.SchDoc; Part Number: Ceramic_0201; FootprintSizeX (mm): 1.5; FootprintSizeY (mm): 0.7; FootprintRectangleArea (mm): 1.05; Thickness (Max) (mm): 0.33; FootprintAlias: 0201
FB5-FB8 = 74279226101: FERRITE BEAD 100 OHM 8A SMD 1812; Manufacturer: Wurth Electronics Inc; Impedance @ Frequency: 100 Ohm @ 100MHz; DC Resistance (DCR): 6 mOhm Max; Filter Type: Differential Mode - Single; Document Name: FPGA_SUP.SchDoc; Part Number: 74279226101; ParamsList: 1812_100Z_8A_6mDCR; Supplier 1: Digi-Key; Supplier Part Number 1: 732-3431-1-ND; Manufacturer Part Number: 74279226101; RoHS: RoHS Compliant; Category: Filters; Stock 1: 4950; Pricing 1: 1=1.04, 25=0.884, 100=0.78, 250=0.728, 500=0.65, 1000=0.624, 2500=0.598 (USD); Current Rating: 8A; Package / Case: 1812 (4532 Metric); Mounting Type: Surface Mount; Packaging: Cut Tape (CT); Height (Max): 0.100" (2.55mm); Size / Dimension: 0.177" L x 0.126" W (4.50mm x 3.20mm); ComponentLink1URL: http://katalog.we-online.de/kataloge/eisos/media/pdf/74279226101.pdf; ComponentLink1Description: http://katalog.we-online.de/kataloge/eisos/media/pdf/74279226101.pdf; FootprintSizeX (mm): 6.3; FootprintSizeY (mm): 3.9; FootprintRectangleArea (mm): 24.57; Thickness (Max) (mm): 2.55; FootprintAlias: 1812
IC2 = XC7A350T-2FFG1156C: Artix-6 FPGA, 16 GTPs, 600 User I/Os, 1156-Pin BGA, Speed Grade 2, Commercial Grade, Pb-Free; Part Description: Artix-7 FPGA, 16 GTPs, 600 User I/Os, 1156-Pin BGA, Speed Grade 2, Commercial Grade, Pb-Free; Manufacturer: XILINX; Table: Logic; Part Number: XC7A350T-2FFG1156C; Component Kind: Standard; Component Type: Standard; Device: XC7A350T-2FFG1156C; PackageDescription: BGA, 1.00mm Pitch, Square; 1156 Pin, 34 Columns X 34 Rows, 35.00mm X 35.00mm X 3.350mm H; Manufacturer Part Number: XC7A350T-2FFG1156C; Pin Count: 1156; Case: BGA1156; Mounted: Yes; Socket: No; SMD: Yes; ComponentHeight: 3.35mm; HelpURL: \\cern.ch\dfs\Applications\Altium\Datasheets\XC7A350T-2FFG1156C.pdf; ComponentLink1URL: \\cern.ch\dfs\Applications\Altium\Datasheets\XC7A350T-2FFG1156C.pdf; ComponentLink1Description: Package/Pinout; Author: CERN DEM JLC; CreateDate: 2012-09-19; LatestRevisionDate: 2012-09-19
IC45 = REF_TL431_SOT23: 2.5V ADJ Voltage reference
L10 L12 = L_CHOKE_ELLVGG: 2.2uH, 1.4A, 92mR Panasonic
R213 = RES_0402: SMD Resistor; Supplier 1: Newark; Supplier Part Number 1: 59M6691

## Sheet SDRAM.SchDoc
size A3; DocumentNumber: 10; SheetNumber: 10; SheetTotal: 30
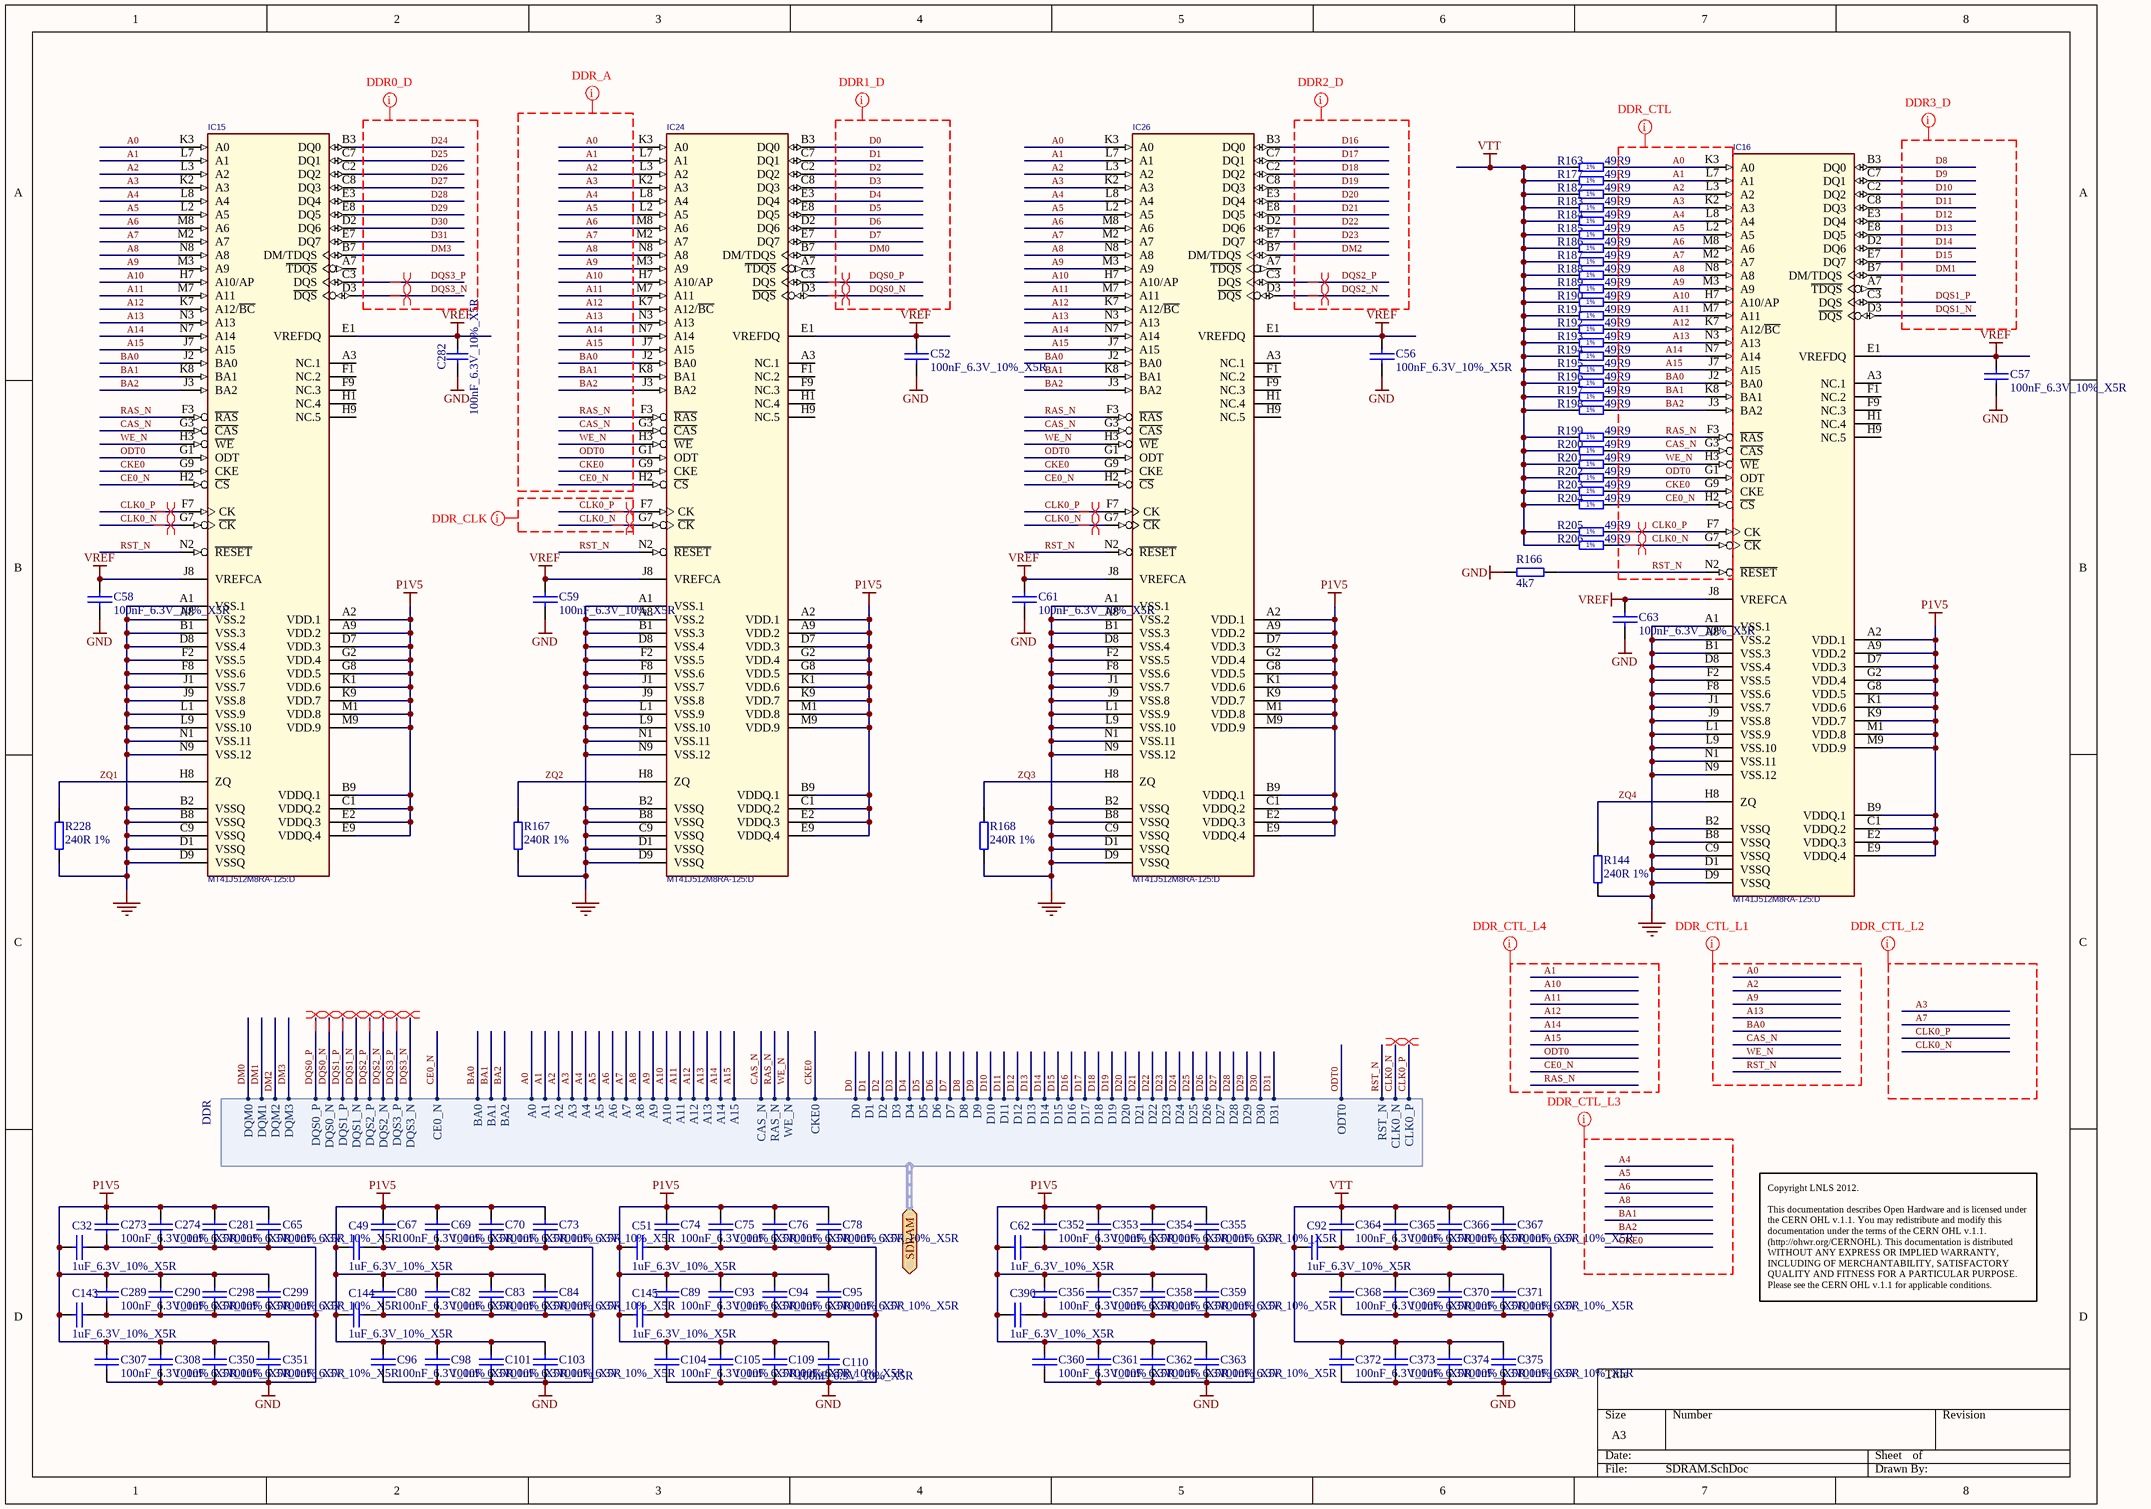
[diagram p11: SDRAM.SchDoc]

### Parts
C32  1uF_6.3V_10%_X5R  [0603C]
C49  1uF_6.3V_10%_X5R  [0603C]
C51  1uF_6.3V_10%_X5R  [0603C]
C52  100nF_6.3V_10%_X5R  [0201C]
C56  100nF_6.3V_10%_X5R  [0201C]
C57  100nF_6.3V_10%_X5R  [0201C]
C58  100nF_6.3V_10%_X5R  [0201C]
C59  100nF_6.3V_10%_X5R  [0201C]
C61  100nF_6.3V_10%_X5R  [0201C]
C62  1uF_6.3V_10%_X5R  [0603C]
C63  100nF_6.3V_10%_X5R  [0201C]
C65  100nF_6.3V_10%_X5R  [0201C]
C67  100nF_6.3V_10%_X5R  [0201C]
C69  100nF_6.3V_10%_X5R  [0201C]
C70  100nF_6.3V_10%_X5R  [0201C]
C73  100nF_6.3V_10%_X5R  [0201C]
C74  100nF_6.3V_10%_X5R  [0201C]
C75  100nF_6.3V_10%_X5R  [0201C]
C76  100nF_6.3V_10%_X5R  [0201C]
C78  100nF_6.3V_10%_X5R  [0201C]
C80  100nF_6.3V_10%_X5R  [0201C]
C82  100nF_6.3V_10%_X5R  [0201C]
C83  100nF_6.3V_10%_X5R  [0201C]
C84  100nF_6.3V_10%_X5R  [0201C]
C89  100nF_6.3V_10%_X5R  [0201C]
C92  1uF_6.3V_10%_X5R  [0603C]
C93  100nF_6.3V_10%_X5R  [0201C]
C94  100nF_6.3V_10%_X5R  [0201C]
C95  100nF_6.3V_10%_X5R  [0201C]
C96  100nF_6.3V_10%_X5R  [0201C]
C98  100nF_6.3V_10%_X5R  [0201C]
C101  100nF_6.3V_10%_X5R  [0201C]
C103  100nF_6.3V_10%_X5R  [0201C]
C104  100nF_6.3V_10%_X5R  [0201C]
C105  100nF_6.3V_10%_X5R  [0201C]
C109  100nF_6.3V_10%_X5R  [0201C]
C110  100nF_6.3V_10%_X5R  [CAPC0603X33N]
C143  1uF_6.3V_10%_X5R  [0603C]
C144  1uF_6.3V_10%_X5R  [0603C]
C145  1uF_6.3V_10%_X5R  [0603C]
C273  100nF_6.3V_10%_X5R  [0201C]
C274  100nF_6.3V_10%_X5R  [0201C]
C281  100nF_6.3V_10%_X5R  [0201C]
C282  100nF_6.3V_10%_X5R  [CAPC0603X33N]
C289  100nF_6.3V_10%_X5R  [0201C]
C290  100nF_6.3V_10%_X5R  [0201C]
C298  100nF_6.3V_10%_X5R  [0201C]
C299  100nF_6.3V_10%_X5R  [0201C]
C307  100nF_6.3V_10%_X5R  [0201C]
C308  100nF_6.3V_10%_X5R  [0201C]
C350  100nF_6.3V_10%_X5R  [0201C]
C351  100nF_6.3V_10%_X5R  [0201C]
C352  100nF_6.3V_10%_X5R  [0201C]
C353  100nF_6.3V_10%_X5R  [0201C]
C354  100nF_6.3V_10%_X5R  [0201C]
C355  100nF_6.3V_10%_X5R  [0201C]
C356  100nF_6.3V_10%_X5R  [0201C]
C357  100nF_6.3V_10%_X5R  [0201C]
C358  100nF_6.3V_10%_X5R  [0201C]
C359  100nF_6.3V_10%_X5R  [0201C]
C360  100nF_6.3V_10%_X5R  [0201C]
C361  100nF_6.3V_10%_X5R  [0201C]
C362  100nF_6.3V_10%_X5R  [0201C]
C363  100nF_6.3V_10%_X5R  [0201C]
C364  100nF_6.3V_10%_X5R  [0201C]
C365  100nF_6.3V_10%_X5R  [0201C]
C366  100nF_6.3V_10%_X5R  [0201C]
C367  100nF_6.3V_10%_X5R  [0201C]
C368  100nF_6.3V_10%_X5R  [0201C]
C369  100nF_6.3V_10%_X5R  [0201C]
C370  100nF_6.3V_10%_X5R  [0201C]
C371  100nF_6.3V_10%_X5R  [0201C]
C372  100nF_6.3V_10%_X5R  [0201C]
C373  100nF_6.3V_10%_X5R  [0201C]
C374  100nF_6.3V_10%_X5R  [0201C]
C375  100nF_6.3V_10%_X5R  [0201C]
C390  1uF_6.3V_10%_X5R  [0603C]
IC15  MT41J512M8RA-125:D  [bga6x13-p8-12p75]
IC16  MT41J512M8RA-125:D  [bga6x13-p8-12p75]
IC24  MT41J512M8RA-125:D  [bga6x13-p8-12p75]
IC26  MT41J512M8RA-125:D  [bga6x13-p8-12p75]
R144  240R 1%  [0402R]
R163  49R9  [RESC1005X40N]
R166  4k7  [0402R]
R167  240R 1%  [0402R]
R168  240R 1%  [0402R]
R177  49R9  [RESC1005X40N]
R182  49R9  [RESC1005X40N]
R183  49R9  [RESC1005X40N]
R184  49R9  [RESC1005X40N]
R185  49R9  [RESC1005X40N]
R186  49R9  [RESC1005X40N]
R187  49R9  [RESC1005X40N]
R188  49R9  [RESC1005X40N]
R189  49R9  [RESC1005X40N]
R190  49R9  [RESC1005X40N]
R191  49R9  [RESC1005X40N]
R192  49R9  [RESC1005X40N]
R193  49R9  [RESC1005X40N]
R194  49R9  [RESC1005X40N]
R195  49R9  [RESC1005X40N]
R196  49R9  [RESC1005X40N]
R197  49R9  [RESC1005X40N]
R198  49R9  [RESC1005X40N]
R199  49R9  [RESC1005X40N]
R200  49R9  [RESC1005X40N]
R201  49R9  [RESC1005X40N]
R202  49R9  [RESC1005X40N]
R203  49R9  [RESC1005X40N]
R204  49R9  [RESC1005X40N]
R205  49R9  [RESC1005X40N]
R206  49R9  [RESC1005X40N]
R228  240R 1%  [0402R]

### Ports
SDRAM (harness DDR)

### Harnesses
DDR: CKE0, A0, A1, A2, A3, A4, A5, A7, A8, A9, A10, A11, A12, A13, BA0, BA1, BA2, A14, A15, CAS_N, RAS_N, WE_N, CE0_N, DQM0, DQM1, A6, D0, D1, D2, D3, D4, D5, D6, D7, D8, D9, D10, D11, D12, D13, D14, D15, CLK0_N, CLK0_P, ODT0, RST_N, D16, D17, D18, D19, D20, D21, D22, D23, D24, D25, D26, D27, D28, D29, D30, D31, DQS0_P, DQS1_P, DQS0_N, DQS1_N, DQS3_N, DQS3_P, DQS2_P, DQS2_N, DQM2, DQM3

### Nets
GND: C32.2 C49.2 C51.2 C52.2 C56.2 C57.2 C58.2 C59.2 C61.2 C62.2 C63.2 C65.2 C67.2 C69.2 C70.2 C73.2 C74.2 C75.2 C76.2 C78.2 C80.2 C82.2 C83.2 C84.2 C89.2 C92.2 C93.2 C94.2 C95.2 C96.2 C98.2 C101.2 C103.2 C104.2 C105.2 C109.2 C110.1 C143.2 C144.2 C145.2 C273.2 C274.2 C281.2 C282.1 C289.2 C290.2 C298.2 C299.2 C307.2 C308.2 C350.2 C351.2 C352.2 C353.2 C354.2 C355.2 C356.2 C357.2 C358.2 C359.2 C360.2 C361.2 C362.2 C363.2 C364.2 C365.2 C366.2 C367.2 C368.2 C369.2 C370.2 C371.2 C372.2 C373.2 C374.2 C375.2 C390.2 IC15.A1(VSS.1) IC15.A8(VSS.2) IC15.B1(VSS.3) IC15.B2(VSSQ) IC15.B8(VSSQ) IC15.C9(VSSQ) IC15.D1(VSSQ) IC15.D8(VSS.4) IC15.D9(VSSQ) IC15.F2(VSS.5) IC15.F8(VSS.6) IC15.J1(VSS.7) IC15.J9(VSS.8) IC15.L1(VSS.9) IC15.L9(VSS.10) IC15.N1(VSS.11) IC15.N9(VSS.12) IC16.A1(VSS.1) IC16.A8(VSS.2) IC16.B1(VSS.3) IC16.B2(VSSQ) IC16.B8(VSSQ) IC16.C9(VSSQ) IC16.D1(VSSQ) IC16.D8(VSS.4) IC16.D9(VSSQ) IC16.F2(VSS.5) IC16.F8(VSS.6) IC16.J1(VSS.7) IC16.J9(VSS.8) IC16.L1(VSS.9) IC16.L9(VSS.10) IC16.N1(VSS.11) IC16.N9(VSS.12) IC24.A1(VSS.1) IC24.A8(VSS.2) IC24.B1(VSS.3) IC24.B2(VSSQ) IC24.B8(VSSQ) IC24.C9(VSSQ) IC24.D1(VSSQ) IC24.D8(VSS.4) IC24.D9(VSSQ) IC24.F2(VSS.5) IC24.F8(VSS.6) IC24.J1(VSS.7) IC24.J9(VSS.8) IC24.L1(VSS.9) IC24.L9(VSS.10) IC24.N1(VSS.11) IC24.N9(VSS.12) IC26.A1(VSS.1) IC26.A8(VSS.2) IC26.B1(VSS.3) IC26.B2(VSSQ) IC26.B8(VSSQ) IC26.C9(VSSQ) IC26.D1(VSSQ) IC26.D8(VSS.4) IC26.D9(VSSQ) IC26.F2(VSS.5) IC26.F8(VSS.6) IC26.J1(VSS.7) IC26.J9(VSS.8) IC26.L1(VSS.9) IC26.L9(VSS.10) IC26.N1(VSS.11) IC26.N9(VSS.12) R144.1 R166.2 R167.1 R168.1 R228.1
P1V5: C32.1 C49.1 C51.1 C62.1 C65.1 C67.1 C69.1 C70.1 C73.1 C74.1 C75.1 C76.1 C78.1 C80.1 C82.1 C83.1 C84.1 C89.1 C93.1 C94.1 C95.1 C96.1 C98.1 C101.1 C103.1 C104.1 C105.1 C109.1 C110.2 C143.1 C144.1 C145.1 C273.1 C274.1 C281.1 C289.1 C290.1 C298.1 C299.1 C307.1 C308.1 C350.1 C351.1 C352.1 C353.1 C354.1 C355.1 C356.1 C357.1 C358.1 C359.1 C360.1 C361.1 C362.1 C363.1 C390.1 IC15.A2(VDD.1) IC15.A9(VDD.2) IC15.B9(VDDQ.1) IC15.C1(VDDQ.2) IC15.D7(VDD.3) IC15.E2(VDDQ.3) IC15.E9(VDDQ.4) IC15.G2(VDD.4) IC15.G8(VDD.5) IC15.K1(VDD.6) IC15.K9(VDD.7) IC15.M1(VDD.8) IC15.M9(VDD.9) IC16.A2(VDD.1) IC16.A9(VDD.2) IC16.B9(VDDQ.1) IC16.C1(VDDQ.2) IC16.D7(VDD.3) IC16.E2(VDDQ.3) IC16.E9(VDDQ.4) IC16.G2(VDD.4) IC16.G8(VDD.5) IC16.K1(VDD.6) IC16.K9(VDD.7) IC16.M1(VDD.8) IC16.M9(VDD.9) IC24.A2(VDD.1) IC24.A9(VDD.2) IC24.B9(VDDQ.1) IC24.C1(VDDQ.2) IC24.D7(VDD.3) IC24.E2(VDDQ.3) IC24.E9(VDDQ.4) IC24.G2(VDD.4) IC24.G8(VDD.5) IC24.K1(VDD.6) IC24.K9(VDD.7) IC24.M1(VDD.8) IC24.M9(VDD.9) IC26.A2(VDD.1) IC26.A9(VDD.2) IC26.B9(VDDQ.1) IC26.C1(VDDQ.2) IC26.D7(VDD.3) IC26.E2(VDDQ.3) IC26.E9(VDDQ.4) IC26.G2(VDD.4) IC26.G8(VDD.5) IC26.K1(VDD.6) IC26.K9(VDD.7) IC26.M1(VDD.8) IC26.M9(VDD.9)
VREF: C52.1 C56.1 C57.1 C58.1 C59.1 C61.1 C63.1 C282.2 IC15.E1(VREFDQ) IC15.J8(VREFCA) IC16.E1(VREFDQ) IC16.J8(VREFCA) IC24.E1(VREFDQ) IC24.J8(VREFCA) IC26.E1(VREFDQ) IC26.J8(VREFCA)
VTT: C92.1 C364.1 C365.1 C366.1 C367.1 C368.1 C369.1 C370.1 C371.1 C372.1 C373.1 C374.1 C375.1 R163.1 R177.1 R182.1 R183.1 R184.1 R185.1 R186.1 R187.1 R188.1 R189.1 R190.1 R191.1 R192.1 R193.1 R194.1 R195.1 R196.1 R197.1 R198.1 R199.1 R200.1 R201.1 R202.1 R203.1 R204.1 R205.1 R206.1
A0: IC15.K3(A0) IC16.K3(A0) IC24.K3(A0) IC26.K3(A0) R163.2 ; port SDRAM.A0  [project net FDDR.A0]
A1: IC15.L7(A1) IC16.L7(A1) IC24.L7(A1) IC26.L7(A1) R177.2 ; port SDRAM.A1  [project net FDDR.A1]
A2: IC15.L3(A2) IC16.L3(A2) IC24.L3(A2) IC26.L3(A2) R182.2 ; port SDRAM.A2  [project net FDDR.A2]
A3: IC15.K2(A3) IC16.K2(A3) IC24.K2(A3) IC26.K2(A3) R183.2 ; port SDRAM.A3  [project net FDDR.A3]
A4: IC15.L8(A4) IC16.L8(A4) IC24.L8(A4) IC26.L8(A4) R184.2 ; port SDRAM.A4  [project net FDDR.A4]
A5: IC15.L2(A5) IC16.L2(A5) IC24.L2(A5) IC26.L2(A5) R185.2 ; port SDRAM.A5  [project net FDDR.A5]
A6: IC15.M8(A6) IC16.M8(A6) IC24.M8(A6) IC26.M8(A6) R186.2 ; port SDRAM.A6  [project net FDDR.A6]
A7: IC15.M2(A7) IC16.M2(A7) IC24.M2(A7) IC26.M2(A7) R187.2 ; port SDRAM.A7  [project net FDDR.A7]
A8: IC15.N8(A8) IC16.N8(A8) IC24.N8(A8) IC26.N8(A8) R188.2 ; port SDRAM.A8  [project net FDDR.A8]
A9: IC15.M3(A9) IC16.M3(A9) IC24.M3(A9) IC26.M3(A9) R189.2 ; port SDRAM.A9  [project net FDDR.A9]
A10: IC15.H7(A10/AP) IC16.H7(A10/AP) IC24.H7(A10/AP) IC26.H7(A10/AP) R190.2 ; port SDRAM.A10  [project net FDDR.A10]
A11: IC15.M7(A11) IC16.M7(A11) IC24.M7(A11) IC26.M7(A11) R191.2 ; port SDRAM.A11  [project net FDDR.A11]
A12: IC15.K7(A12/~{BC}) IC16.K7(A12/~{BC}) IC24.K7(A12/~{BC}) IC26.K7(A12/~{BC}) R192.2 ; port SDRAM.A12  [project net FDDR.A12]
A13: IC15.N3(A13) IC16.N3(A13) IC24.N3(A13) IC26.N3(A13) R193.2 ; port SDRAM.A13  [project net FDDR.A13]
A14: IC15.N7(A14) IC16.N7(A14) IC24.N7(A14) IC26.N7(A14) R194.2 ; port SDRAM.A14  [project net FDDR.A14]
A15: IC15.J7(A15) IC16.J7(A15) IC24.J7(A15) IC26.J7(A15) R195.2 ; port SDRAM.A15  [project net FDDR.A15]
BA0: IC15.J2(BA0) IC16.J2(BA0) IC24.J2(BA0) IC26.J2(BA0) R196.2 ; port SDRAM.BA0  [project net FDDR.BA0]
BA1: IC15.K8(BA1) IC16.K8(BA1) IC24.K8(BA1) IC26.K8(BA1) R197.2 ; port SDRAM.BA1  [project net FDDR.BA1]
BA2: IC15.J3(BA2) IC16.J3(BA2) IC24.J3(BA2) IC26.J3(BA2) R198.2 ; port SDRAM.BA2  [project net FDDR.BA2]
CAS_N: IC15.G3(~{CAS}) IC16.G3(~{CAS}) IC24.G3(~{CAS}) IC26.G3(~{CAS}) R200.2 ; port SDRAM.CAS_N  [project net FDDR.CAS_N]
CE0_N: IC15.H2(~{CS}) IC16.H2(~{CS}) IC24.H2(~{CS}) IC26.H2(~{CS}) R204.2 ; port SDRAM.CE0_N  [project net FDDR.CE0_N]
CKE0: IC15.G9(CKE) IC16.G9(CKE) IC24.G9(CKE) IC26.G9(CKE) R203.2 ; port SDRAM.CKE0  [project net FDDR.CKE0]
CLK0_N: IC15.G7(~{CK}) IC16.G7(~{CK}) IC24.G7(~{CK}) IC26.G7(~{CK}) R206.2 ; port SDRAM.CLK0_N  [project net FDDR.CLK0_N]
CLK0_P: IC15.F7(CK) IC16.F7(CK) IC24.F7(CK) IC26.F7(CK) R205.2 ; port SDRAM.CLK0_P  [project net FDDR.CLK0_P]
D0: IC24.B3(DQ0) ; port SDRAM.D0  [project net FDDR.D0]
D1: IC24.C7(DQ1) ; port SDRAM.D1  [project net FDDR.D1]
D2: IC24.C2(DQ2) ; port SDRAM.D2  [project net FDDR.D2]
D3: IC24.C8(DQ3) ; port SDRAM.D3  [project net FDDR.D3]
D4: IC24.E3(DQ4) ; port SDRAM.D4  [project net FDDR.D4]
D5: IC24.E8(DQ5) ; port SDRAM.D5  [project net FDDR.D5]
D6: IC24.D2(DQ6) ; port SDRAM.D6  [project net FDDR.D6]
D7: IC24.E7(DQ7) ; port SDRAM.D7  [project net FDDR.D7]
D8: IC16.B3(DQ0) ; port SDRAM.D8  [project net FDDR.D8]
D9: IC16.C7(DQ1) ; port SDRAM.D9  [project net FDDR.D9]
D10: IC16.C2(DQ2) ; port SDRAM.D10  [project net FDDR.D10]
D11: IC16.C8(DQ3) ; port SDRAM.D11  [project net FDDR.D11]
D12: IC16.E3(DQ4) ; port SDRAM.D12  [project net FDDR.D12]
D13: IC16.E8(DQ5) ; port SDRAM.D13  [project net FDDR.D13]
D14: IC16.D2(DQ6) ; port SDRAM.D14  [project net FDDR.D14]
D15: IC16.E7(DQ7) ; port SDRAM.D15  [project net FDDR.D15]
D16: IC26.B3(DQ0) ; port SDRAM.D16  [project net FDDR.D16]
D17: IC26.C7(DQ1) ; port SDRAM.D17  [project net FDDR.D17]
D18: IC26.C2(DQ2) ; port SDRAM.D18  [project net FDDR.D18]
D19: IC26.C8(DQ3) ; port SDRAM.D19  [project net FDDR.D19]
D20: IC26.E3(DQ4) ; port SDRAM.D20  [project net FDDR.D20]
D21: IC26.E8(DQ5) ; port SDRAM.D21  [project net FDDR.D21]
D22: IC26.D2(DQ6) ; port SDRAM.D22  [project net FDDR.D22]
D23: IC26.E7(DQ7) ; port SDRAM.D23  [project net FDDR.D23]
D24: IC15.B3(DQ0) ; port SDRAM.D24  [project net FDDR.D24]
D25: IC15.C7(DQ1) ; port SDRAM.D25  [project net FDDR.D25]
D26: IC15.C2(DQ2) ; port SDRAM.D26  [project net FDDR.D26]
D27: IC15.C8(DQ3) ; port SDRAM.D27  [project net FDDR.D27]
D28: IC15.E3(DQ4) ; port SDRAM.D28  [project net FDDR.D28]
D29: IC15.E8(DQ5) ; port SDRAM.D29  [project net FDDR.D29]
D30: IC15.D2(DQ6) ; port SDRAM.D30  [project net FDDR.D30]
D31: IC15.E7(DQ7) ; port SDRAM.D31  [project net FDDR.D31]
DM0: IC24.B7(DM/TDQS) ; port SDRAM.DQM0  [project net FDDR.DQM0]
DM1: IC16.B7(DM/TDQS) ; port SDRAM.DQM1  [project net FDDR.DQM1]
DM2: IC26.B7(DM/TDQS) ; port SDRAM.DQM2  [project net FDDR.DQM2]
DM3: IC15.B7(DM/TDQS) ; port SDRAM.DQM3  [project net FDDR.DQM3]
DQS0_N: IC24.D3(~{DQS}) ; port SDRAM.DQS0_N  [project net FDDR.DQS0_N]
DQS0_P: IC24.C3(DQS) ; port SDRAM.DQS0_P  [project net FDDR.DQS0_P]
DQS1_N: IC16.D3(~{DQS}) ; port SDRAM.DQS1_N  [project net FDDR.DQS1_N]
DQS1_P: IC16.C3(DQS) ; port SDRAM.DQS1_P  [project net FDDR.DQS1_P]
DQS2_N: IC26.D3(~{DQS}) ; port SDRAM.DQS2_N  [project net FDDR.DQS2_N]
DQS2_P: IC26.C3(DQS) ; port SDRAM.DQS2_P  [project net FDDR.DQS2_P]
DQS3_N: IC15.D3(~{DQS}) ; port SDRAM.DQS3_N  [project net FDDR.DQS3_N]
DQS3_P: IC15.C3(DQS) ; port SDRAM.DQS3_P  [project net FDDR.DQS3_P]
ODT0: IC15.G1(ODT) IC16.G1(ODT) IC24.G1(ODT) IC26.G1(ODT) R202.2 ; port SDRAM.ODT0  [project net FDDR.ODT0]
RAS_N: IC15.F3(~{RAS}) IC16.F3(~{RAS}) IC24.F3(~{RAS}) IC26.F3(~{RAS}) R199.2 ; port SDRAM.RAS_N  [project net FDDR.RAS_N]
RST_N: IC15.N2(~{RESET}) IC16.N2(~{RESET}) IC24.N2(~{RESET}) IC26.N2(~{RESET}) R166.1 ; port SDRAM.RST_N  [project net FDDR.RST_N]
WE_N: IC15.H3(~{WE}) IC16.H3(~{WE}) IC24.H3(~{WE}) IC26.H3(~{WE}) R201.2 ; port SDRAM.WE_N  [project net FDDR.WE_N]
ZQ1: IC15.H8(ZQ) R228.2
ZQ2: IC24.H8(ZQ) R167.2
ZQ3: IC26.H8(ZQ) R168.2
ZQ4: IC16.H8(ZQ) R144.2

Not connected (* = marked no-connect by the designer): IC15 A3(NC.1) A7(~{TDQS}) F1(NC.2) F9(NC.3) H1(NC.4) H9(NC.5); IC16 A3(NC.1) A7(~{TDQS}) F1(NC.2) F9(NC.3) H1(NC.4) H9(NC.5); IC24 A3(NC.1) A7(~{TDQS}) F1(NC.2) F9(NC.3) H1(NC.4) H9(NC.5); IC26 A3(NC.1) A7(~{TDQS}) F1(NC.2) F9(NC.3) H1(NC.4) H9(NC.5)

### Layout directives
differential pair: FDDR.CLK0_N, FDDR.CLK0_P, FDDR.DQS0_N, FDDR.DQS0_P, FDDR.DQS1_N, FDDR.DQS1_P, FDDR.DQS2_N, FDDR.DQS2_P, FDDR.DQS3_N, FDDR.DQS3_P
net class DDR1_D: D0, D1, D2, D3, D4, D5, D6, D7, DM0, DQS0_N, DQS0_P
net class DDR_A: A0, A1, A2, A3, A4, A5, A6, A7, A8, A9, A10, A11, A12, A13, A14, A15, BA0, BA1, BA2, CAS_N, CE0_N, CKE0, ODT0, RAS_N, WE_N
net class DDR0_D: D24, D25, D26, D27, D28, D29, D30, D31, DM3, DQS3_N, DQS3_P
net class DDR2_D: D16, D17, D18, D19, D20, D21, D22, D23, DM2, DQS2_N, DQS2_P
net class DDR3_D: D8, D9, D10, D11, D12, D13, D14, D15, DM1, DQS1_N, DQS1_P
net class DDR_CLK: CLK0_N, CLK0_P
net class DDR_CTL: A0, A1, A2, A3, A4, A5, A6, A7, A8, A9, A10, A11, A12, A13, A14, A15, BA0, BA1, BA2, CAS_N, CE0_N, CKE0, CLK0_N, CLK0_P, ODT0, RAS_N, RST_N, WE_N
net class DDR_CTL_L4: A1, A10, A11, A12, A14, A15, CE0_N, ODT0, RAS_N
net class DDR_CTL_L1: A0, A2, A9, A13, BA0, CAS_N, RST_N, WE_N
net class DDR_CTL_L2: A3, A7, CLK0_N, CLK0_P
net class DDR_CTL_L3: A4, A5, A6, A8, BA1, BA2, CKE0

### Notes on the sheet
- Copyright LNLS 2012.
  This documentation describes Open Hardware and is licensed under the CERN OHL v.1.1. You may redistribute and modify this documentation under the terms of the CERN OHL v.1.1. (http://ohwr.org/CERNOHL). This documentation is distributed WITHOUT ANY EXPRESS OR IMPLIED WARRANTY, INCLUDING OF MERCHANTABILITY, SATISFACTORY QUALITY AND FITNESS FOR A PARTICULAR PURPOSE. Please see the CERN OHL v.1.1 for applicable conditions.
- (in symbol R0402_43R_1%_0.0625W_100PPM) 1%

### Library data of the parts
C32 C49 C51 C62 C92 C143-C145 C390 = CAP_SMD_0603: Capacitor SMD; Supplier 1: Digi-Key; Supplier Part Number 1: 490-1524-2-ND
C52 C56-C59 C61 C63 C65 C67 C69 C70 C73-C76 C78 C80 C82-C84 C89 C93-C96 C98 C101 C103-C105 C109 C273 C274 C281 C289 C290 C298 C299 C307 C308 C350-C375 = CAP_SMD_0201: Capacitor SMD
C110 C282 = CC0201_100NF_6.3V_10%_X5R: Non-polarised capacitor; Part Description: SMD Multilayer Chip Ceramic Capacitor; Manufacturer: GENERIC; Manufacturer1 Part Number: 02016D104KAT2A; Value: 100nF; Voltage: 6.3V; TC: X5R; Tolerance: ±10%; Table: Capacitors SMD; Part Number: CC0201_100NF_6.3V_10%_X5R; Component Kind: Standard; Component Type: Standard; Pin Count: 2; Status: Not Recommended; Manufacturer Part Number: CC0201_100NF_6.3V_10%_X5R; Case: 0201; Mounted: Yes; Socket: No; SMD: Yes; Manufacturer1 Example: AVX; Manufacturer1 ComponentHeight: 0.33mm; HelpURL: \\cern.ch\dfs\Applications\Altium\Datasheets\CC0201_X5R_AVX.pdf; Author: CERN DEM JLC; CreateDate: 2007-12-03; LatestRevisionDate: 2007-12-03
IC15 IC16 IC24 IC26 = MEM_MT41J512M8: 512x8 DDR3 SDRAM; Supplier 1: Arrow; Supplier Part Number 1: 51515418S9110300N2406
R144 R166-R168 R228 = RES_0402: SMD Resistor; Supplier 1: Newark; Supplier Part Number 1: 59M6691
R163 R177 R182-R206 = R0402_43R_1%_0.0625W_100PPM: Resistor - 1%; Part Number: R0402_49R9_1%_0.0625W_100PPM; Part Description: General Purpose Thick Film Chip Resistor; Manufacturer: GENERIC; Manufacturer1 Part Number: 232270674309; TC: ±100ppm/°C; Table: Resistors SMD; Component Kind: Standard; Component Type: Standard; Pin Count: 2; Value: 49R9; Status: Not recommended; Power: 0.0625W; Tolerance: ±1%; Manufacturer Part Number: R0402_49R9_1%_0.0625W_100PPM; Case: 0402; Mounted: Yes; Socket: No; SMD: Yes; Manufacturer1 Example: PHYCOMP; Manufacturer1 ComponentHeight: 0.4mm; HelpURL: \\cern.ch\dfs\Applications\Altium\Datasheets\R0402_Phycomp_RC0402.pdf; Author: CERN DEM JLC; CreateDate: 2007-12-03; LatestRevisionDate: 2008-03-13